# Altium project sigcarrier.PrjPcb (part 1 of 2)
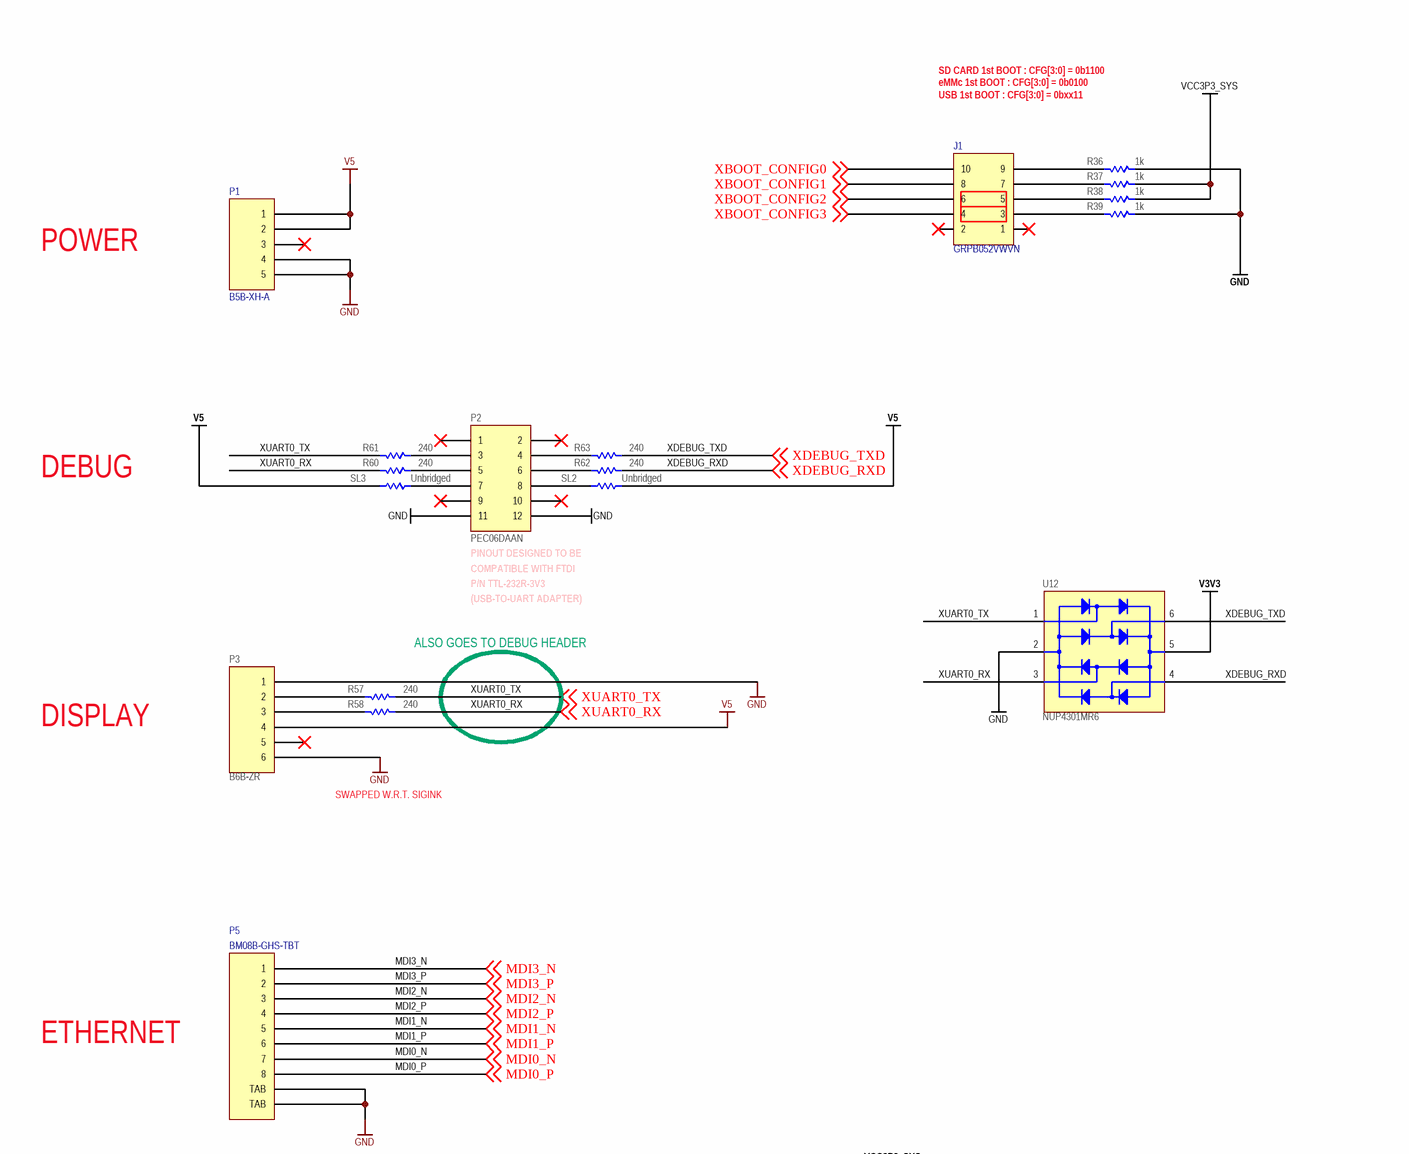
[diagram p0: 01_main.SchDoc, top left]
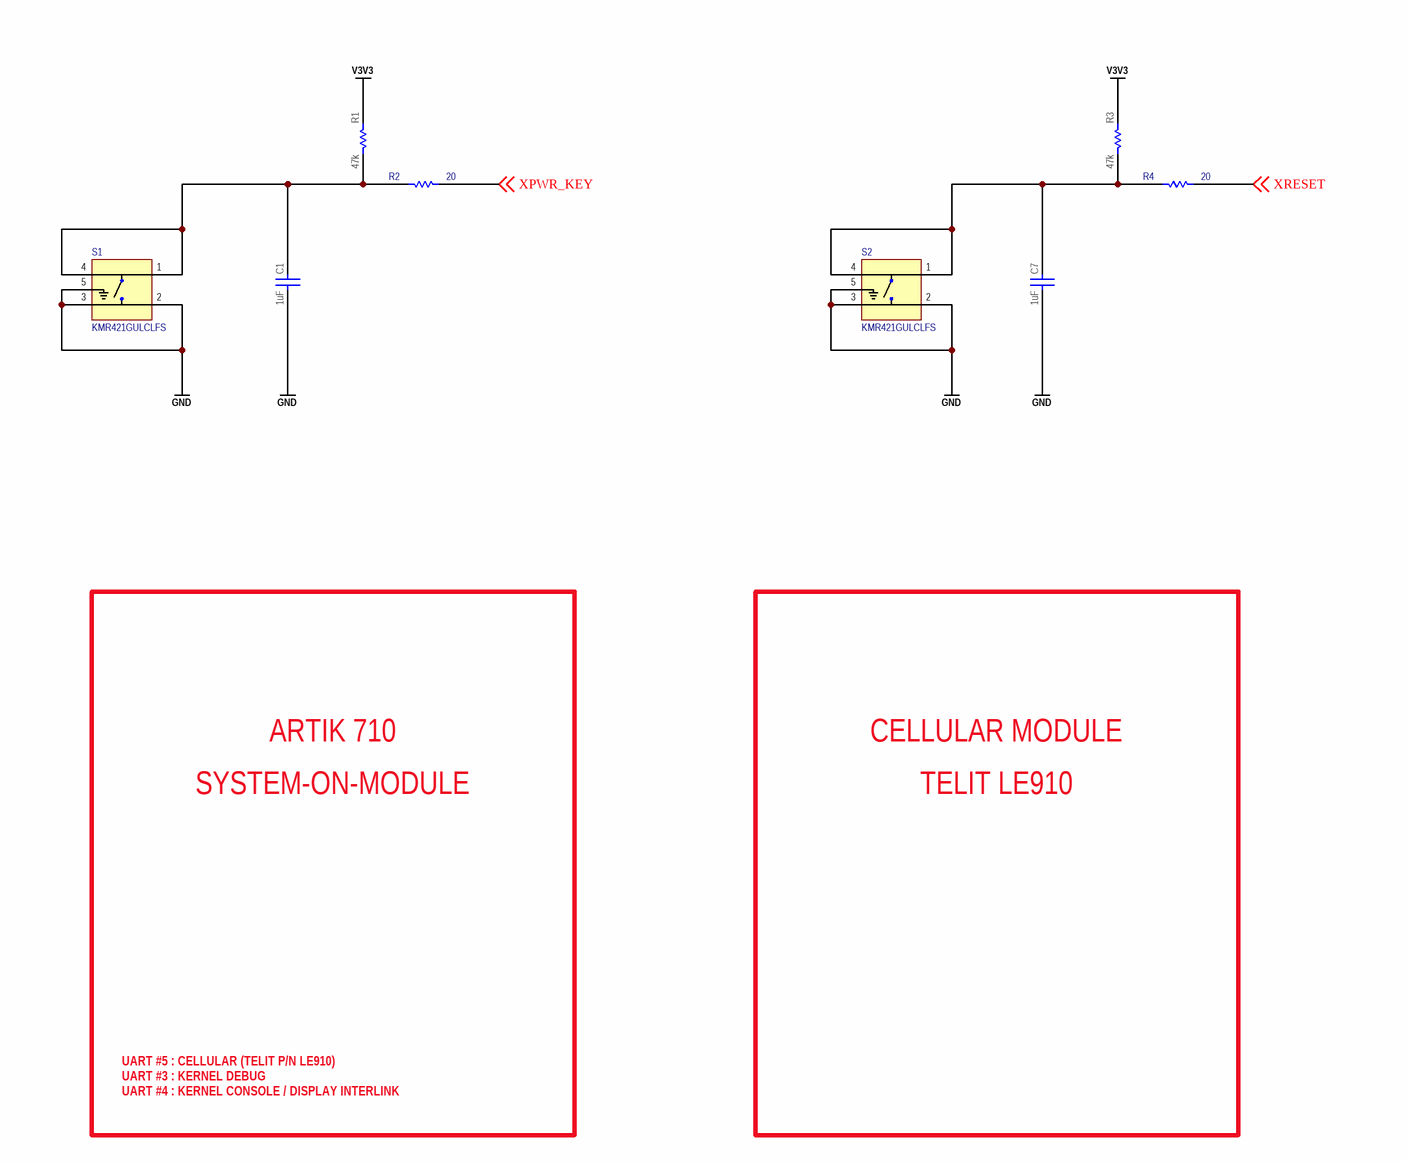
[diagram p1: 01_main.SchDoc, top right]
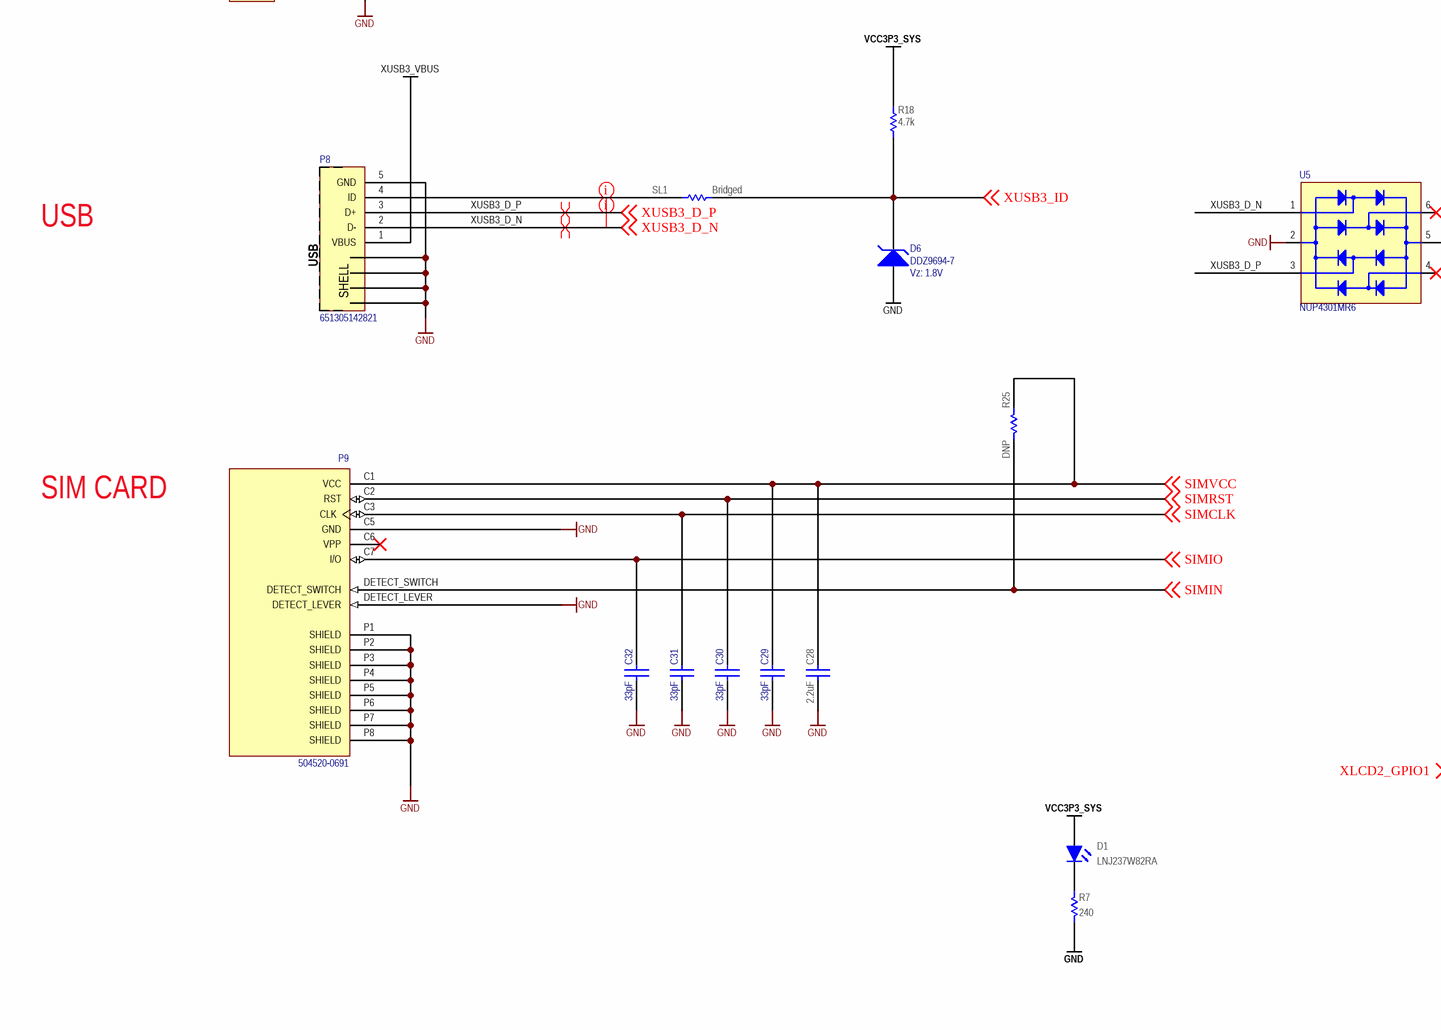
[diagram p2: 01_main.SchDoc, bottom left]
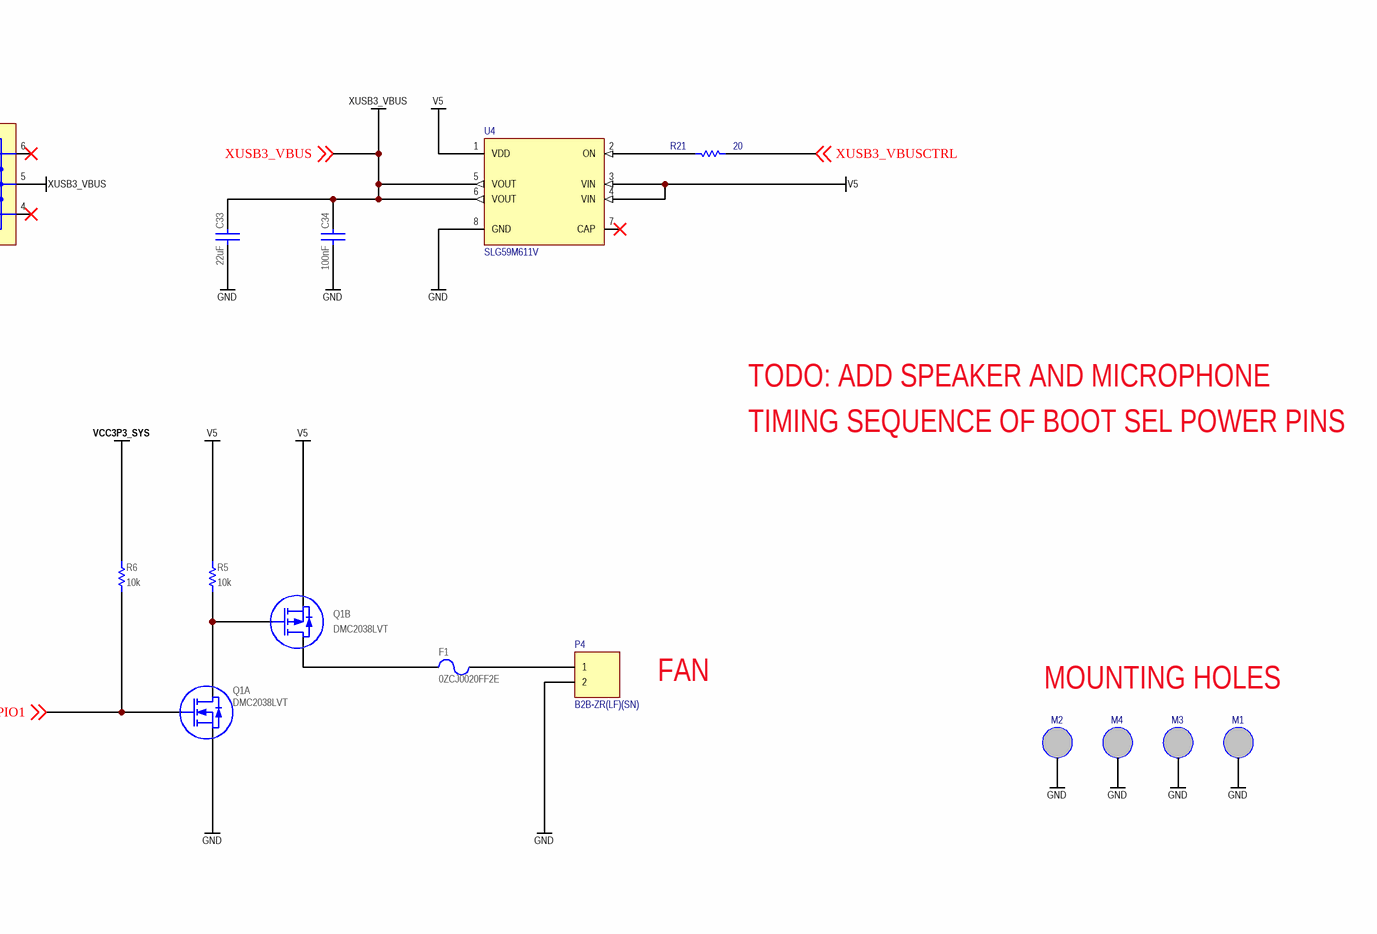
[diagram p3: 01_main.SchDoc, bottom right]
5 sheets, 184 parts. Net scope: global (net labels, ports and power ports of the same name join across sheets).
Board file: sigcarrier.PcbDoc
Sheets:
  01_main.SchDoc
  03_cellular.SchDoc
  02_som.SchDoc
  04_ethernet.SchDoc
  05_power.SchDoc

## Sheet 01_main.SchDoc
size C; CompanyName: Signal Laboratories, Inc.; Address1: 3479 Edison Way; Address2: Menlo Park CA 94025; Address3: +1 (877) 778-8435; Address4: siglabs.com; Revision: 1; SheetNumber: 1; SheetTotal: 1

### Parts
C1  value 1uF  [CAPC160X80X90L20N]  (hidden comment: C1608X7R1A105M080)
C7  value 1uF  [CAPC160X80X90L20N]  (hidden comment: C1608X7R1A105M080)
C28  value 2.2uF  [CAPC160X80X90L20N]  (hidden comment: C1608X7R1A225M080)
C29  value 33pF  [0402]  (hidden comment: CBR04C330F5GAC)
C30  value 33pF  [0402]  (hidden comment: CBR04C330F5GAC)
C31  value 33pF  [0402]  (hidden comment: CBR04C330F5GAC)
C32  value 33pF  [0402]  (hidden comment: CBR04C330F5GAC)
C33  value 22uF  [CAPC200X125X145L45N]  (hidden comment: C2012X7S1A226M125)
C34  value 100nF  [CAPC100X50X55L25N]  (hidden comment: GCM155R71H104KE02)
D1  LNJ237W82RA  [0603_LED]
D6  DDZ9694-7  Vz: 1.8V  [SOD123]
F1  0ZCJ0020FF2E  [1206]
J1  GRPB052VWVN  [GRPB052VWVN]
M1  MOUNT350  [mount350]  (value not drawn)  (no BOM)
M2  MOUNT350  [mount350]  (value not drawn)  (no BOM)
M3  MOUNT350  [mount350]  (value not drawn)  (no BOM)
M4  MOUNT350  [mount350]  (value not drawn)  (no BOM)
P1  B5B-XH-A  [B5B-XH-A]
P2  PEC06DAAN  [HDR2X6]
P3  B6B-ZR  [B6B-ZR]
P4  B2B-ZR(LF)(SN)  [B2B-ZR]
P5  BM08B-GHS-TBT  [BM08B-GHS-TBT]
P8  651305142821  [651305142821]
P9  504520-0691  [504520-0691]
Q1  DMC2038LVT  [TSOP-6]  (parts A,B of 2)
R1  value 47k  [RESC1005X40N]  (hidden comment: ERJ-2RKF4702X)
R2  value 20  [0402]  (hidden comment: ERJ-2RKF20R0X)
R3  value 47k  [RESC1005X40N]  (hidden comment: ERJ-2RKF4702X)
R4  value 20  [0402]  (hidden comment: ERJ-2RKF20R0X)
R5  value 10k  [RESC1005X40N]  (hidden comment: ERJ-2RKF1002X)
R6  value 10k  [RESC1005X40N]  (hidden comment: ERJ-2RKF1002X)
R7  value 240  [RESC1005X40N]  (hidden comment: ERJ-2RKF2400X)
R18  value 4.7k  [RESC1005X40N]  (hidden comment: ERJ-2RKF4701X)
R21  value 20  [0402]  (hidden comment: ERJ-2RKF20R0X)
R25  Do Not Place: DNP  [RESC1005X40N]  (hidden comment: ERJ-2RKF4702X)
R36  value 1k  [RESC1005X40N]  (hidden comment: ERJ-2RKF1001X)
R37  value 1k  [RESC1005X40N]  (hidden comment: ERJ-2RKF1001X)
R38  value 1k  [RESC1005X40N]  (hidden comment: ERJ-2RKF1001X)
R39  value 1k  [RESC1005X40N]  (hidden comment: ERJ-2RKF1001X)
R57  value 240  [RESC1005X40N]  (hidden comment: ERJ-2RKF2400X)
R58  value 240  [RESC1005X40N]  (hidden comment: ERJ-2RKF2400X)
R60  value 240  [RESC1005X40N]  (hidden comment: ERJ-2RKF2400X)
R61  value 240  [RESC1005X40N]  (hidden comment: ERJ-2RKF2400X)
R62  value 240  [RESC1005X40N]  (hidden comment: ERJ-2RKF2400X)
R63  value 240  [RESC1005X40N]  (hidden comment: ERJ-2RKF2400X)
S1  KMR421GULCLFS  [SW_KMR421GULCLFS]
S2  KMR421GULCLFS  [SW_KMR421GULCLFS]
SL1  value Bridged  [SOLDERLINK0603X26N_BRIDGED]  (hidden comment: SOLDER_LINK_BRIDGED)  (no BOM)
SL2  value Unbridged  [SOLDERLINK0603X26N]  (hidden comment: SOLDER_LINK)  (no BOM)
SL3  value Unbridged  [SOLDERLINK0603X26N]  (hidden comment: SOLDER_LINK)  (no BOM)
U4  SLG59M611V  [DFN200X150X80-8N]
U5  NUP4301MR6  [SOT23-6]
U12  NUP4301MR6  [SOT23-6]

### Nets
GND: C1.1 C7.1 C28.1 C29.2 C30.2 C31.2 C32.2 C33.1 C34.1 D6.1(A) M1.1(GND) M2.1(GND) M3.1(GND) M4.1(GND) P1.4 P1.5 P2.11 P2.12 P3.1 P3.6 P4.2 P5.9(TAB) P5.10(TAB) P8.5(GND) P8.SHELL(SHIELD) P8.SHELL1(SHIELD) P8.SHELL2(SHIELD) P8.SHELL3(SHIELD) P9.C5(GND) P9.DETECT_LEVER P9.P1(SHIELD) P9.P2(SHIELD) P9.P3(SHIELD) P9.P4(SHIELD) P9.P5(SHIELD) P9.P6(SHIELD) P9.P7(SHIELD) P9.P8(SHIELD) Q1.5(S) R7.2 R36.2 R39.2 S1.2 S1.3 S1.5(G) S2.2 S2.3 S2.5(G) U4.8(GND) U5.2(VN) U12.2(VN)
V3V3: R1.2 R3.2 U12.5(VP)
V5: P1.1 P1.2 P3.4 Q1.2(S) R5.2 SL2.2 SL3.1 U4.1(VDD) U4.3(VIN) U4.4(VIN)
VCC3P3_SYS: D1.1(A) R6.2 R18.2 R37.2 R38.2
XUSB3_VBUS: C33.2 C34.2 P8.1(VBUS) U4.5(VOUT) U4.6(VOUT) U5.5(VP) ; off-sheet XUSB3_VBUS
MDI0_N: P5.7 ; off-sheet MDI0_N
MDI0_P: P5.8 ; off-sheet MDI0_P
MDI1_N: P5.5 ; off-sheet MDI1_N
MDI1_P: P5.6 ; off-sheet MDI1_P
MDI2_N: P5.3 ; off-sheet MDI2_N
MDI2_P: P5.4 ; off-sheet MDI2_P
MDI3_N: P5.1 ; off-sheet MDI3_N
MDI3_P: P5.2 ; off-sheet MDI3_P
SIMCLK: C31.1 P9.C3(CLK) ; off-sheet SIMCLK
SIMIN: P9.DETECT_SWITCH R25.1 ; off-sheet SIMIN
SIMIO: C32.1 P9.C7(I/O) ; off-sheet SIMIO
SIMRST: C30.1 P9.C2(RST) ; off-sheet SIMRST
SIMVCC: C28.2 C29.1 P9.C1(VCC) R25.2 ; off-sheet SIMVCC
XBOOT_CONFIG0: J1.10 ; off-sheet XBOOT_CONFIG0
XBOOT_CONFIG1: J1.8 ; off-sheet XBOOT_CONFIG1
XBOOT_CONFIG2: J1.6 ; off-sheet XBOOT_CONFIG2
XBOOT_CONFIG3: J1.4 ; off-sheet XBOOT_CONFIG3
XDEBUG_RXD: R62.2 U12.4(C) ; off-sheet XDEBUG_RXD
XDEBUG_TXD: R63.2 U12.6(D) ; off-sheet XDEBUG_TXD
XLCD2_GPIO1: Q1.1(G) R6.1 ; off-sheet XLCD2_GPIO1
XPWR_KEY: R2.2 ; off-sheet XPWR_KEY
XRESET: R4.2 ; off-sheet XRESET
XUART0_RX: R58.2 R60.1 U12.3(B) ; off-sheet XUART0_RX
XUART0_TX: R57.2 R61.1 U12.1(A) ; off-sheet XUART0_TX
XUSB3_D_N: P8.2(D-) U5.1(A) ; off-sheet XUSB3_D_N
XUSB3_D_P: P8.3(D+) U5.3(B) ; off-sheet XUSB3_D_P
XUSB3_ID: D6.2(C) R18.1 SL1.2 ; off-sheet XUSB3_ID
XUSB3_VBUSCTRL: R21.2 ; off-sheet XUSB3_VBUSCTRL
NetC1_2: C1.2 R1.1 R2.1 S1.1 S1.4
NetC7_2: C7.2 R3.1 R4.1 S2.1 S2.4
NetD1_2: D1.2(K) R7.1
NetF1_1: F1.1 Q1.4(D)
NetF1_2: F1.2 P4.1
NetJ1_3: J1.3 R39.1
NetJ1_5: J1.5 R38.1
NetJ1_7: J1.7 R37.1
NetJ1_9: J1.9 R36.1
NetP2_3: P2.3 R61.2
NetP2_4: P2.4 R63.1
NetP2_5: P2.5 R60.2
NetP2_6: P2.6 R62.1
NetP2_7: P2.7 SL3.2
NetP2_8: P2.8 SL2.1
NetP3_2: P3.2 R57.1
NetP3_3: P3.3 R58.1
NetP8_4: P8.4(ID) SL1.1
NetQ1_3: Q1.3(G) Q1.6(D) R5.1
NetR21_1: R21.1 U4.2(ON)

Not connected (* = marked no-connect by the designer): J1 1* 2*; P1 3*; P2 1* 2* 9* 10*; P3 5*; P9 C6(VPP)*; U4 7(CAP)*; U5 4(C)* 6(D)*

### Layout directives
net class USB: XUSB3_D_N, XUSB3_D_P
differential pair: XUSB3_D_N, XUSB3_D_P

### Notes on the sheet
- SD CARD 1st BOOT : CFG[3:0] = 0b1100
  eMMc 1st BOOT : CFG[3:0] = 0b0100
  USB 1st BOOT : CFG[3:0] = 0bxx11
- POWER
- DEBUG
- (near P2) PINOUT DESIGNED TO BE
- (near P2) COMPATIBLE WITH FTDI
- P/N TTL-232R-3V3
- (USB-TO-UART ADAPTER)
- ALSO GOES TO DEBUG HEADER
- DISPLAY
- ARTIK 710
- CELLULAR MODULE
- SWAPPED W.R.T. SIGINK
- SYSTEM-ON-MODULE
- TELIT LE910
- ETHERNET
- UART #5 : CELLULAR (TELIT P/N LE910)
  UART #3 : KERNEL DEBUG
  UART #4 : KERNEL CONSOLE / DISPLAY INTERLINK
- USB
- TODO: ADD SPEAKER AND MICROPHONE
- SIM CARD
- TIMING SEQUENCE OF BOOT SEL POWER PINS
- FAN
- MOUNTING HOLES
- Title
- Engineer
- Revision
- Drawn By
- Sheet
- of
- Checked By
- Date
- (in symbol 651305142821) USB

### Library data of the parts
C1 C7 = CAP: Ceramic Capacitor 1uF ±20% 10V X7R 0603; Manufacturer: TDK; Tr: -55:125; Manufacturer P/N: C1608X7R1A105M080; Tolerance: ±20%; Voltage: 10V; Footprint: *; Package: 0603
C28 = CAP: Ceramic Capacitor 2.2uF ±20% 10V X7R 0603; Manufacturer: TDK; Tr: -55:125; Manufacturer P/N: C1608X7R1A225M080; Tolerance: ±20%; Voltage: 10V; Footprint: *; Package: 0603
C29-C32 = CAP 0603: Ceramic Capacitor 33pF ±1% 50V NP0 0402; Manufacturer: Kemet; Tr: -55:125; Voltage: 50V; Manufacturer P/N: CBR04C330F5GAC; Package: 0402; Do Not Place: *; Tolerance: ±1%
C33 = CAP: Ceramic Capacitor 22uF ±20% 10V X7S 0805; Manufacturer: TDK; Tr: -55:125; Manufacturer P/N: C2012X7S1A226M125; Tolerance: ±20%; Voltage: 10V; Package: 0805
C34 = CAP: Ceramic Capacitor 100nF ±10% 50V X7R 0402; Manufacturer: Murata; Tr: -55:125; Manufacturer P/N: GCM155R71H104KE02; Tolerance: ±10%; Voltage: 50V; Footprint: *; Package: 0402
D1 = LED0603RD: LED, SMT 0603, Color Red, 5mA, 1.85V; Manufacturer: Panasonic; Manufacturer P/N: LNJ237W82RA; Package: 0603 Polarized
D6 = DDZ9694-7: Zener Diode 1.8V 500mW SOD123; Manufacturer P/N: DDZ9678-7; Manufacturer: Diodes, Inc.
F1 = 0ZCJ0020FF2E: PTC Resettable Fuse, 0.2A, 30V, SMD 1206; Manufacturer: Bell Fuse; Manufacturer P/N: 0ZCJ0020FF2E
J1 = GRPB052VWVN: Male Header, 0.050" Pitch, 2x5 Position; Manufacturer: Sullins; Manufacturer P/N: GRPB052VWVN
M1-M4 = M3_HOLE
P1 = B5B-XH-A: 2.5mm pitch 5-position; Manufacturer: JST; Manufacturer P/N: B5B-XH-A
P2 = Header 6X2H: Header, 6-Pin, Dual row; Manufacturer: Sullins; Manufacturer P/N: PEC06DAAN
P3 = TBD: Header, 6-Pin, Single row, Vertical; Manufacturer: JST; Manufacturer P/N: B6B-ZR
P4 = Header 2: Header, 2-Pin; Manufacturer: JST; Manufacturer P/N: B2B-ZR(LF)(SN)
P5 = BM08B-GHS-TBT: Top Entry Shrouded Connector; 8-position; Manufacturer: JST; Manufacturer P/N: BM08B-GHS-TBT
P8 = 651305142821: Right Angle SMT USB Type-AB Connector Receptacle; Manufacturer: Wurth Elektronik; Manufacturer P/N: 651305142821
P9 = 504520-0691: micro-SIM Card Connector; Manufacturer: Molex; Availability: Good; Package: None; Manufacturer P/N: 504520-0691; Price: 1.31 USD; Value: *
Q1 = DMC2038LVT: Complementary MOSFET Pair; Manufacturer: Diodes, Inc.; Manufacturer P/N: DMC2038LVT
R1 R3 R25 = RES: Thick Film Resistor 47k ±1% 0.1W 75V 0402; Manufacturer: Panasonic; Tcr: ±100; Tr: -55:155; Voltage: 75; Power: 0.1; Tolerance: ±1%; Manufacturer P/N: ERJ-2RKF4702X; Alternatives: *; Footprint: *; Package: 0402
  R25: Value: 47k
R2 R4 R21 = RES 0402: Thick Film Resistor 20 ±1% 0402; Manufacturer: Panasonic; Manufacturer P/N: RC0402FR-0720L; Tr: -55:155; Package: 0402; Tolerance: ±1%
R5 R6 = RES: Thick Film Resistor 10k ±1% 0.1W 0402; Manufacturer: Panasonic; Tcr: ±100; Tr: -55:155; Voltage: 50; Power: 0.1; Manufacturer P/N: ERJ-2RKF1002X; Tolerance: ±1%; Alternatives: *; Footprint: *; Package: 0402
R7 R57 R58 R60-R63 = RES: Thick Film Resistor 240 ±1% 0.1W 75V 0402; Manufacturer: Panasonic; Tcr: ±100; Tr: -55:155; Voltage: 75; Power: 0.1; Tolerance: ±1%; Manufacturer P/N: ERJ-2RKF2400X; Alternatives: *; Footprint: *; Package: 0402
R18 = RES: Thick Film Resistor 4.7k ±1% 0.1W 75V 0402; Manufacturer: Panasonic; Tcr: ±100; Tr: -55:155; Voltage: 75; Power: 0.1; Tolerance: ±1%; Manufacturer P/N: ERJ-2RKF4701X; Alternatives: *; Footprint: *; Package: 0402
R36-R39 = RES: Thick Film Resistor 1k ±1% 0.1W 0402; Manufacturer: Panasonic; Tcr: ±100; Tr: -55:155; Voltage: 75; Power: 0.1; Tolerance: ±1%; Manufacturer P/N: ERJ-2RKF1001X; Alternatives: *; Footprint: *; Package: 0402
S1 S2 = KMR421GULCLFS: Switch Tactile N.O. SPST Round Button Gull Wing 0.05A 32VDC 1VA 200000Cycles 2N SMD Automotive T/R; Manufacturer: C&K Components; Availability: Good; Package: None; Manufacturer P/N: KMR421GULCLFS; Price: 0.29 USD; Value: *
SL1 = RES: Solder Link Bridged; Manufacturer P/N: *; Manufacturer: *
SL2 SL3 = RES: Solder Link Unbridged; Manufacturer P/N: *; Manufacturer: *
U4 = SLG59M611V: High-Side Load Switch; Manufacturer: Silego; Package: WFDFN-8 Silego; Manufacturer P/N: SLG59M611V
U5 U12 = NUP4301MR6: 4-Lane TVS Diode Array; Manufacturer: On Semiconductor; Manufacturer P/N: NUP4301MR6

## Sheet 03_cellular.SchDoc
size D; CompanyName: Signal Laboratories, Inc.; Address1: 3479 Edison Way; Address2: Menlo Park CA 94025; Address3: +1 (877) 778-8435; Address4: siglabs.com; Revision: 1; SheetNumber: 1; SheetTotal: 1
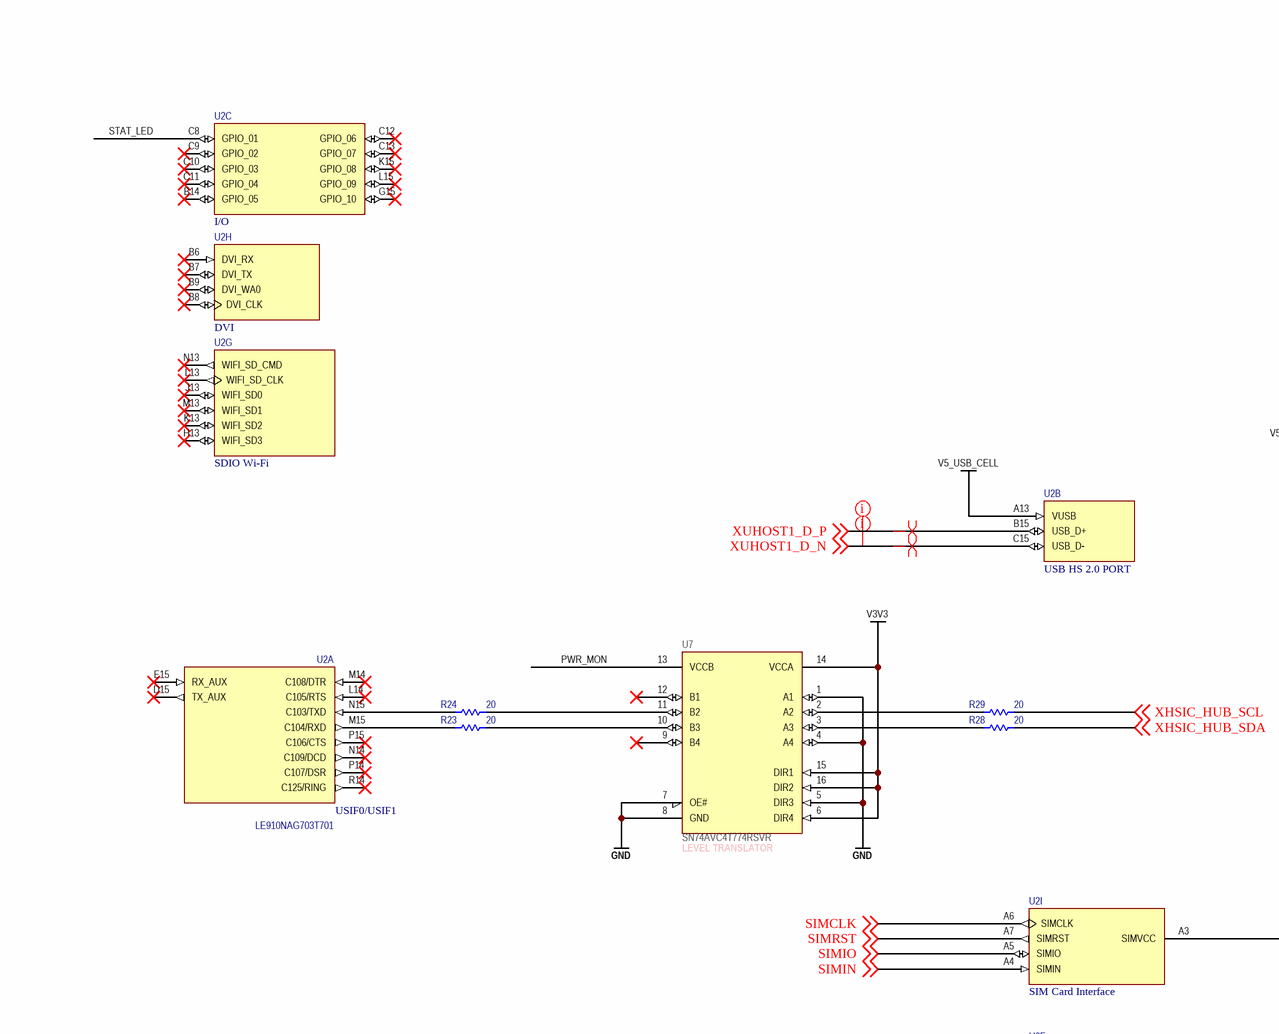
[diagram p4: 03_cellular.SchDoc, top left]
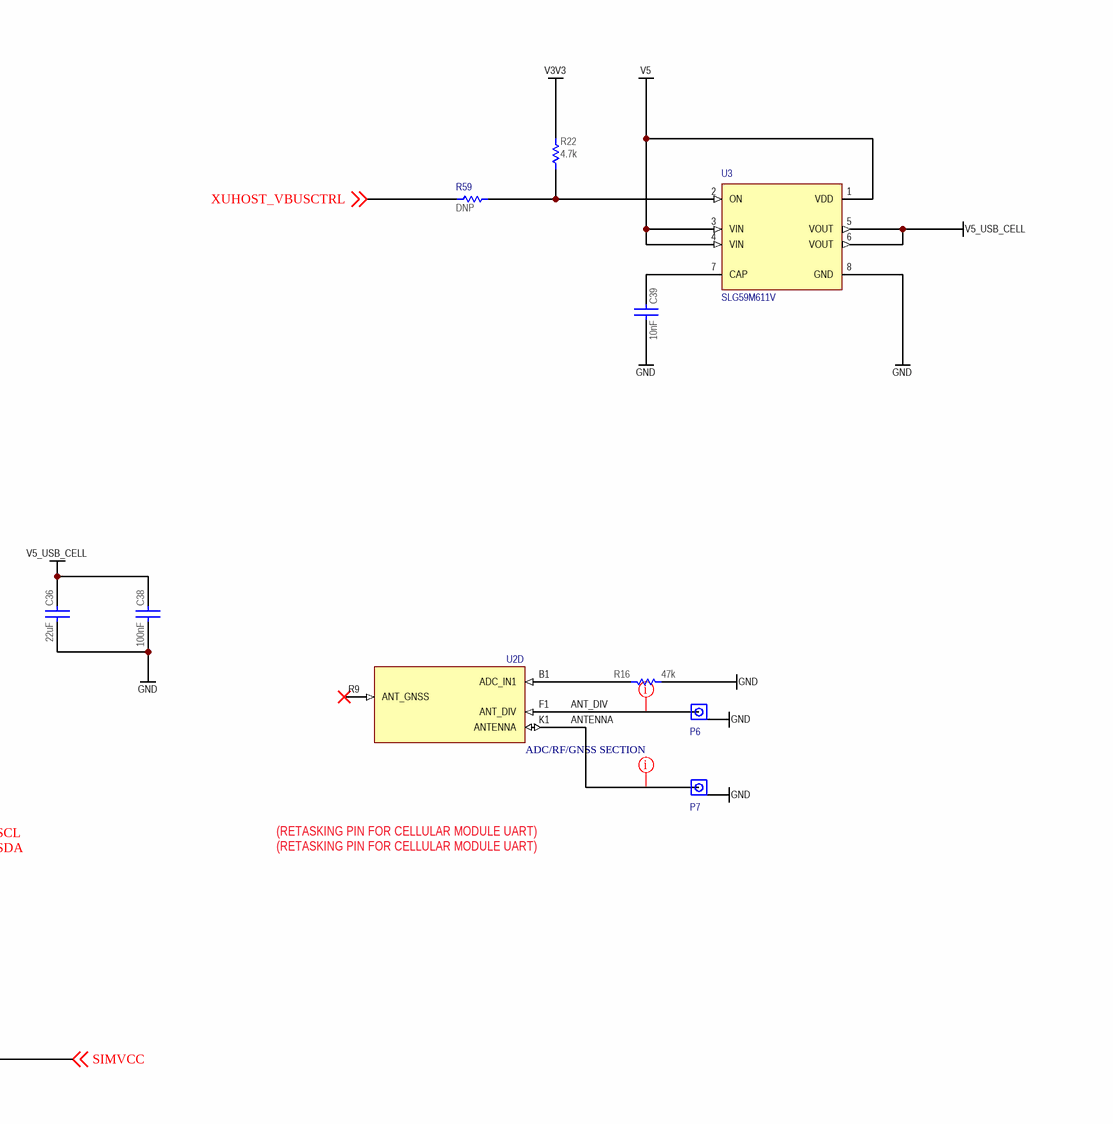
[diagram p5: 03_cellular.SchDoc, top right]
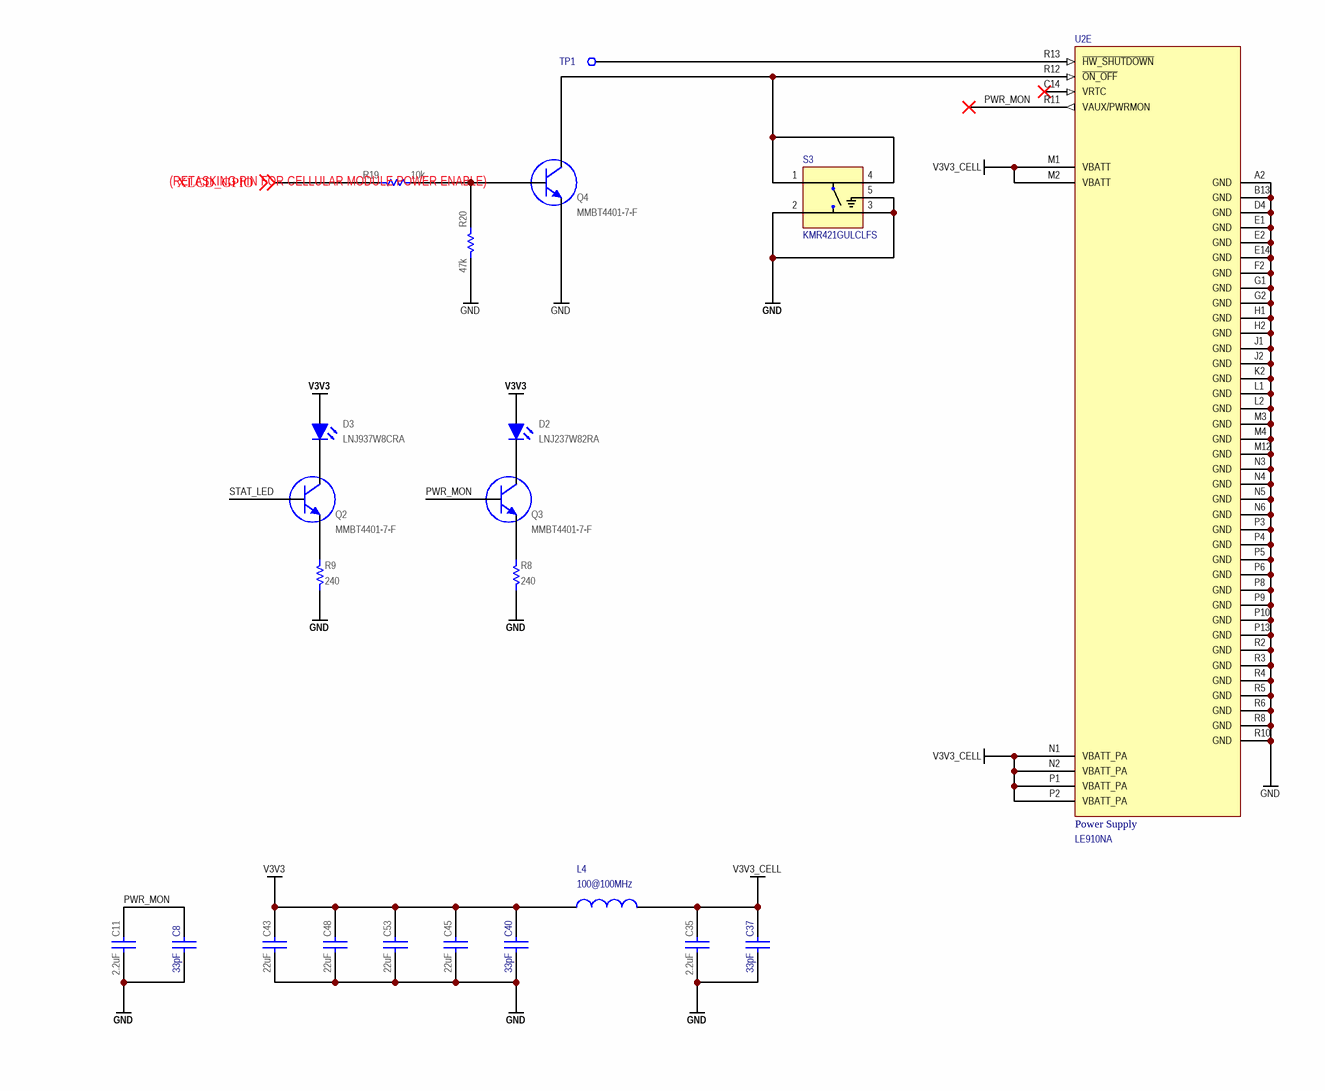
[diagram p6: 03_cellular.SchDoc, bottom left]
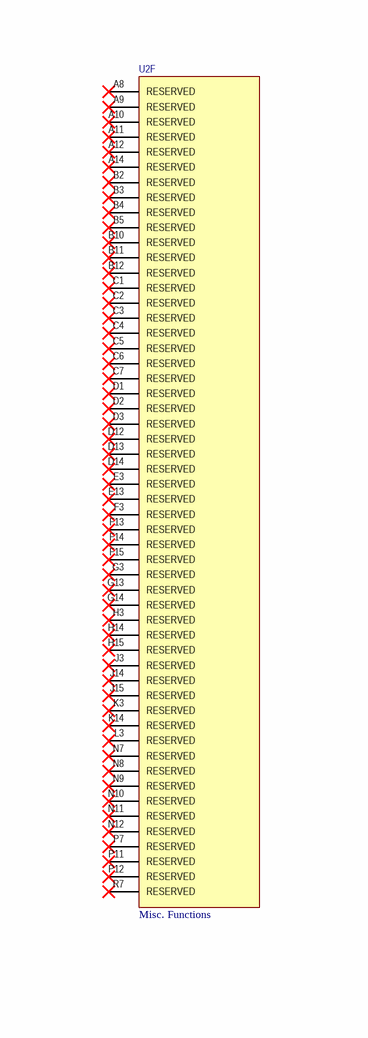
[diagram p7: 03_cellular.SchDoc, bottom right]

### Parts
C8  value 33pF  [0402]  (hidden comment: CBR04C330F5GAC)
C11  value 2.2uF  [CAPC160X80X90L20N]  (hidden comment: C1608X7R1A225M080)
C35  value 2.2uF  [CAPC160X80X90L20N]  (hidden comment: C1608X7R1A225M080)
C36  value 22uF  [CAPC200X125X145L45N]  (hidden comment: C2012X7S1A226M125)
C37  value 33pF  [0402]  (hidden comment: CBR04C330F5GAC)
C38  value 100nF  [CAPC100X50X55L25N]  (hidden comment: GCM155R71H104KE02)
C39  value 10nF  [CAPC100X50X55L25N]  (hidden comment: GCM155R71H103KA55)
C40  value 33pF  [0402]  (hidden comment: CBR04C330F5GAC)
C43  value 22uF  [CAPC200X125X145L45N]  (hidden comment: C2012X7S1A226M125)
C45  value 22uF  [CAPC200X125X145L45N]  (hidden comment: C2012X7S1A226M125)
C48  value 22uF  [CAPC200X125X145L45N]  (hidden comment: C2012X7S1A226M125)
C53  value 22uF  [CAPC200X125X145L45N]  (hidden comment: C2012X7S1A226M125)
D2  LNJ237W82RA  [0603_LED]
D3  LNJ937W8CRA  [0603_LED]
L4  value 100@100MHz  [0603]  (hidden comment: BLM15PX601SN1D)
P6  U.FL-R-SMT(10)  [U.FL-R-SMT(10)]  (value not drawn)
P7  U.FL-R-SMT(10)  [U.FL-R-SMT(10)]  (value not drawn)
Q2  MMBT4401-7-F  [SOT23]
Q3  MMBT4401-7-F  [SOT23]
Q4  MMBT4401-7-F  [SOT23]
R8  value 240  [RESC1005X40N]  (hidden comment: ERJ-2RKF2400X)
R9  value 240  [RESC1005X40N]  (hidden comment: ERJ-2RKF2400X)
R16  value 47k  [RESC1005X40N]  (hidden comment: ERJ-2RKF4702X)
R19  value 10k  [RESC1005X40N]  (hidden comment: ERJ-2RKF1002X)
R20  value 47k  [RESC1005X40N]  (hidden comment: ERJ-2RKF4702X)
R22  value 4.7k  [RESC1005X40N]  (hidden comment: ERJ-2RKF4701X)
R23  value 20  [0402]  (hidden comment: ERJ-2RKF20R0X)
R24  value 20  [0402]  (hidden comment: ERJ-2RKF20R0X)
R28  value 20  [0402]  (hidden comment: ERJ-2RKF20R0X)
R29  value 20  [0402]  (hidden comment: ERJ-2RKF20R0X)
R59  Do Not Place: DNP  [0402]  (hidden comment: ERJ-2RKF20R0X)
S3  KMR421GULCLFS  [SW_KMR421GULCLFS]
TP1  TEST_POINT_SMD_10  [TEST_POINT_SMD_10]  (value not drawn)  (no BOM)
U2  LE910NAG703T701  [LGA144S180P15X15_2820X2820X225_LE910NAG703T701(Primary)]  (parts A,B,C,D,E,F,G,H,I of 9)
U3  SLG59M611V  [DFN200X150X80-8N]
U7  SN74AVC4T774RSVR  [RSV]

### Nets
GND: C8.2 C11.1 C35.1 C36.1 C37.2 C38.1 C39.1 C40.2 C43.1 C45.1 C48.1 C53.1 P6.2(GND) P7.2(GND) Q4.2(E) R8.2 R9.2 R16.1 R20.1 S3.2 S3.3 S3.5(G) U2.A2(GND) U2.B13(GND) U2.D4(GND) U2.E1(GND) U2.E2(GND) U2.E14(GND) U2.F2(GND) U2.G1(GND) U2.G2(GND) U2.H1(GND) U2.H2(GND) U2.J1(GND) U2.J2(GND) U2.K2(GND) U2.L1(GND) U2.L2(GND) U2.M3(GND) U2.M4(GND) U2.M12(GND) U2.N3(GND) U2.N4(GND) U2.N5(GND) U2.N6(GND) U2.P3(GND) U2.P4(GND) U2.P5(GND) U2.P6(GND) U2.P8(GND) U2.P9(GND) U2.P10(GND) U2.P13(GND) U2.R2(GND) U2.R3(GND) U2.R4(GND) U2.R5(GND) U2.R6(GND) U2.R8(GND) U2.R10(GND) U3.8(GND) U7.1(A1) U7.4(A4) U7.5(DIR3) U7.7(OE#) U7.8(GND)
V3V3: C40.1 C43.2 C45.2 C48.2 C53.2 D2.1(A) D3.1(A) L4.1 R22.2 U7.6(DIR4) U7.14(VCCA) U7.15(DIR1) U7.16(DIR2)
V3V3_CELL: C35.2 C37.1 L4.2 U2.M1(VBATT) U2.M2(VBATT) U2.N1(VBATT_PA) U2.N2(VBATT_PA) U2.P1(VBATT_PA) U2.P2(VBATT_PA)
V5: U3.1(VDD) U3.3(VIN) U3.4(VIN)
V5_USB_CELL: C36.2 C38.2 U2.A13(VUSB) U3.5(VOUT) U3.6(VOUT)
ANT_DIV: P6.1(RF) U2.F1(ANT_DIV)
ANTENNA: P7.1(RF) U2.K1(ANTENNA)
PWR_MON: C8.1 C11.2 Q3.1(B) U2.R11(VAUX/PWRMON) U7.13(VCCB)
SIMCLK: U2.A6(SIMCLK) ; off-sheet SIMCLK
SIMIN: U2.A4(SIMIN) ; off-sheet SIMIN
SIMIO: U2.A5(SIMIO) ; off-sheet SIMIO
SIMRST: U2.A7(SIMRST) ; off-sheet SIMRST
SIMVCC: U2.A3(SIMVCC) ; off-sheet SIMVCC
STAT_LED: Q2.1(B) U2.C8(GPIO_01)
XHSIC_HUB_SCL: R29.1 ; off-sheet XHSIC_HUB_SCL
XHSIC_HUB_SDA: R28.1 ; off-sheet XHSIC_HUB_SDA
XLCD_GPIO: R19.2 ; off-sheet XLCD_GPIO
XUHOST1_D_N: U2.C15(USB_D-) ; off-sheet XUHOST1_D_N
XUHOST1_D_P: U2.B15(USB_D+) ; off-sheet XUHOST1_D_P
XUHOST_VBUSCTRL: R59.2 ; off-sheet XUHOST_VBUSCTRL
NetC39_2: C39.2 U3.7(CAP)
NetD2_2: D2.2(K) Q3.3(C)
NetD3_2: D3.2(K) Q2.3(C)
NetQ2_2: Q2.2(E) R9.1
NetQ3_2: Q3.2(E) R8.1
NetQ4_1: Q4.1(B) R19.1 R20.2
NetQ4_3: Q4.3(C) S3.1 S3.4 U2.R12(~{ON_OFF})
NetR16_2: R16.2 U2.B1(ADC_IN1)
NetR22_1: R22.1 R59.1 U3.2(ON)
NetR23_1: R23.1 U7.10(B3)
NetR23_2: R23.2 U2.M15(C104/RXD)
NetR24_1: R24.1 U7.11(B2)
NetR24_2: R24.2 U2.N15(C103/TXD)
NetR28_2: R28.2 U7.3(A3)
NetR29_2: R29.2 U7.2(A2)
NetTP1_1: TP1.1 U2.R13(~{HW_SHUTDOWN})

Not connected (* = marked no-connect by the designer): U2 A8(RESERVED)* A9(RESERVED)* A10(RESERVED)* A11(RESERVED)* A12(RESERVED)* A14(RESERVED)* B2(RESERVED)* B3(RESERVED)* B4(RESERVED)* B5(RESERVED)* B6(DVI_RX)* B7(DVI_TX)* B8(DVI_CLK)* B9(DVI_WA0)* B10(RESERVED)* B11(RESERVED)* B12(RESERVED)* B14(GPIO_05)* C1(RESERVED)* C2(RESERVED)* C3(RESERVED)* C4(RESERVED)* C5(RESERVED)* C6(RESERVED)* C7(RESERVED)* C9(GPIO_02)* C10(GPIO_03)* C11(GPIO_04)* C12(GPIO_06)* C13(GPIO_07)* C14(VRTC)* D1(RESERVED)* D2(RESERVED)* D3(RESERVED)* D12(RESERVED)* D13(RESERVED)* D14(RESERVED)* D15(TX_AUX)* E3(RESERVED)* E13(RESERVED)* E15(RX_AUX)* F3(RESERVED)* F13(RESERVED)* F14(RESERVED)* F15(RESERVED)* G3(RESERVED)* G13(RESERVED)* G14(RESERVED)* G15(GPIO_10)* H3(RESERVED)* H13(WIFI_SD3)* H14(RESERVED)* H15(RESERVED)* J3(RESERVED)* J13(WIFI_SD0)* J14(RESERVED)* J15(RESERVED)* K3(RESERVED)* K13(WIFI_SD2)* K14(RESERVED)* K15(GPIO_08)* L3(RESERVED)* L13(WIFI_SD_CLK)* L14(C105/RTS)* L15(GPIO_09)* M13(WIFI_SD1)* M14(C108/DTR)* N7(RESERVED)* N8(RESERVED)* N9(RESERVED)* N10(RESERVED)* N11(RESERVED)* N12(RESERVED)* N13(WIFI_SD_CMD)* N14(C109/DCD)* P7(RESERVED)* P11(RESERVED)* P12(RESERVED)* P14(C107/DSR)* P15(C106/CTS)* R7(RESERVED)* R9(ANT_GNSS)* R14(C125/RING)*; U7 9(B4)* 12(B1)*

### Layout directives
net class RF: ANT_DIV, ANTENNA
net class USB: XUHOST1_D_N, XUHOST1_D_P
differential pair: XUHOST1_D_N, XUHOST1_D_P

### Notes on the sheet
- (RETASKING PIN FOR CELLULAR MODULE UART)
- (near U7) LEVEL TRANSLATOR
- (RETASKING PIN FOR CELLULAR MODULE POWER ENABLE)
- Title
- Engineer
- Revision
- Drawn By
- Sheet
- of
- Checked By
- Date
- (in symbol LE910NAG703T701, part A) USIF0/USIF1
- (in symbol LE910NAG703T701, part B) USB HS 2.0 PORT
- (in symbol LE910NAG703T701, part C) I/O
- (in symbol LE910NAG703T701, part D) ADC/RF/GNSS SECTION
- (in symbol LE910NAG703T701, part E) Power Supply
- (in symbol LE910NAG703T701, part F) Misc. Functions
- (in symbol LE910NAG703T701, part G) SDIO Wi-Fi
- (in symbol LE910NAG703T701, part H) DVI
- (in symbol LE910NAG703T701, part I) SIM Card Interface

### Library data of the parts
C8 C37 C40 = CAP 0603: as C29 on sheet 01_main; Voltage: 50V; Manufacturer P/N: CBR04C330F5GAC; Package: 0402; Do Not Place: *; Tolerance: ±1%
C11 C35 = CAP: as C28 on sheet 01_main; Manufacturer P/N: C1608X7R1A225M080; Tolerance: ±20%; Voltage: 10V; Footprint: *; Package: 0603
C36 C43 C45 C48 C53 = CAP: as C33 on sheet 01_main; Manufacturer P/N: C2012X7S1A226M125; Tolerance: ±20%; Voltage: 10V; Package: 0805
C38 = CAP: as C34 on sheet 01_main; Manufacturer P/N: GCM155R71H104KE02; Tolerance: ±10%; Voltage: 50V; Footprint: *; Package: 0402
C39 = CAP: Ceramic Capacitor 10nF ±10% 50V X7R 0402; Manufacturer: Murata; Tr: -55:125; Manufacturer P/N: GCM155R71H103KA55; Tolerance: ±10%; Voltage: 50V; Footprint: *; Package: 0402
D2 = LED0603RD: as D1 on sheet 01_main; Manufacturer P/N: LNJ237W82RA; Package: 0603 Polarized
D3 = LED0603GR: LED, SMT 0603, Color Blue, 5mA, 2.9V; Manufacturer: Panasonic; Manufacturer P/N: LNJ937W8CRA; Package: 0603 Polarized
L4 = IND 0402: Ferrite Bead 100-Ohm @ 100MHz 2A 0603; Manufacturer: Murata; Manufacturer P/N: BLM18EG101TN1; Tolerance: ±25%; Tr: -55:125; Package: 0603
P6 P7 = U.FL-R-SMT(10): Ultra Miniature Coaxial Jack, 50 Ohms; Manufacturer: Hirose; Manufacturer P/N: U.FL-R-SMT(10)
Q2-Q4 = MMBT4401-7-F: NPN Small Signal Transistor SMD SOT-23; Manufacturer: Diodes, Inc.; Manufacturer P/N: MMBT4401-7-F
R8 R9 = RES: as R7 on sheet 01_main; Tolerance: ±1%; Manufacturer P/N: ERJ-2RKF2400X; Alternatives: *; Footprint: *; Package: 0402
R16 R20 = RES: as R1 on sheet 01_main; Tolerance: ±1%; Manufacturer P/N: ERJ-2RKF4702X; Alternatives: *; Footprint: *; Package: 0402
R19 = RES: Thick Film Resistor 10k ±1% 0.1W 0402; Manufacturer: Panasonic; Tcr: ±100; Tr: -55:155; Voltage: 75; Power: 0.1; Tolerance: ±1%; Manufacturer P/N: ERJ-2RKF1002X; Alternatives: *; Footprint: *; Package: 0402
R22 = RES: as R18 on sheet 01_main; Tolerance: ±1%; Manufacturer P/N: ERJ-2RKF4701X; Alternatives: *; Footprint: *; Package: 0402
R23 R24 R28 R29 = RES 0402: as R2 on sheet 01_main; Package: 0402; Tolerance: ±1%
R59 = RES 0402: Thick Film Resistor 20 ±1% 0402; Manufacturer: Panasonic; Manufacturer P/N: RC0402FR-0720L; Value: 20; Tr: -55:155; Package: 0402; Tolerance: ±1%
S3 = KMR421GULCLFS: as S1 on sheet 01_main; Availability: Good; Package: None; Manufacturer P/N: KMR421GULCLFS; Price: 0.29 USD; Value: *
TP1 = TEST_POINT_SMD_10: Test Point SMD
U2 = LE910NAG703T701: Manufacturer: Telit; Manufacturer P/N: LE910NAG703T701
U3 = SLG59M611V: as U4 on sheet 01_main; Package: WFDFN-8 Silego; Manufacturer P/N: SLG59M611V
U7 = SN74AVC4T774RSVR: 4-Bit Dual-Supply Bus Transceiver; Manufacturer: Texas Instruments; Manufacturer P/N: SN74AVC4T774RSVR

## Sheet 02_som.SchDoc
size D; CompanyName: Signal Laboratories, Inc.; Address1: 3479 Edison Way; Address2: Menlo Park CA 94025; Address3: +1 (877) 778-8435; Address4: siglabs.com; Revision: 1; SheetNumber: 1; SheetTotal: 1
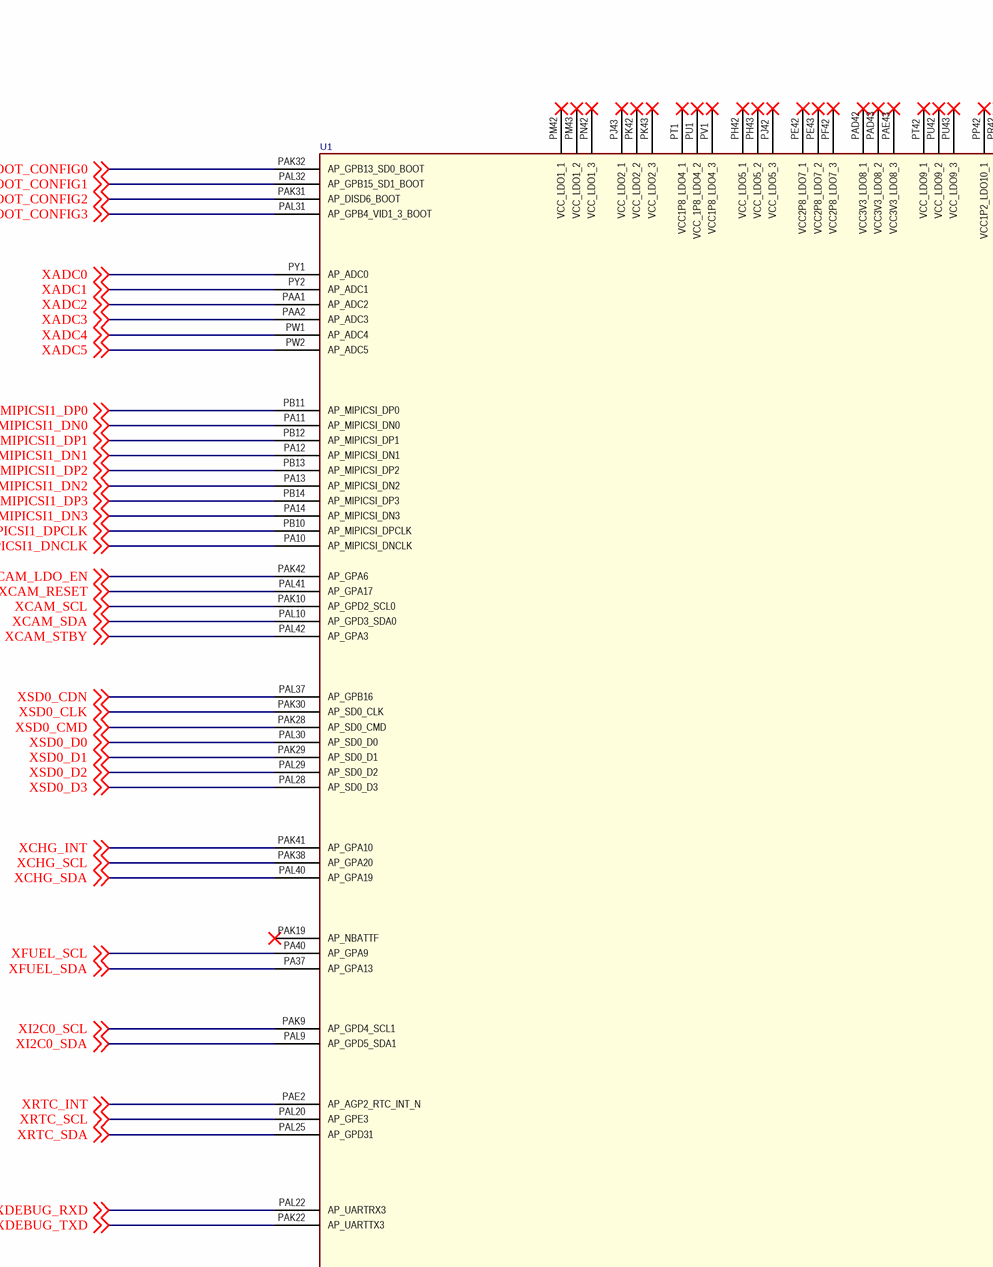
[diagram p8: 02_som.SchDoc, top left]
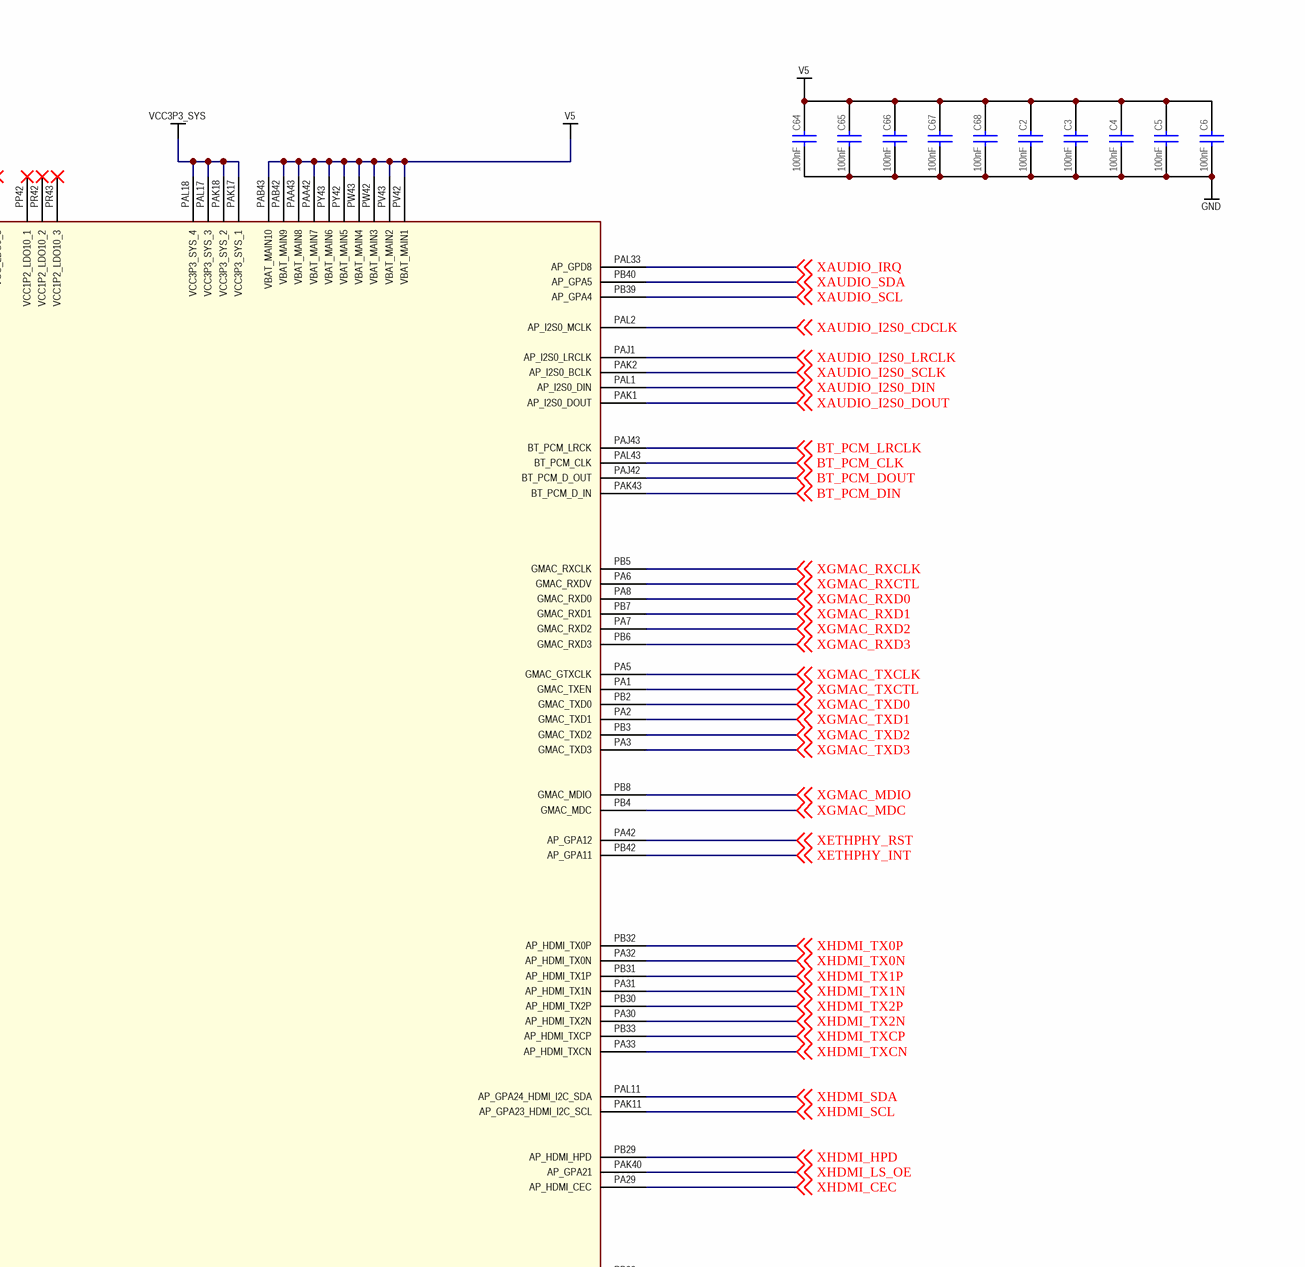
[diagram p9: 02_som.SchDoc, top right]
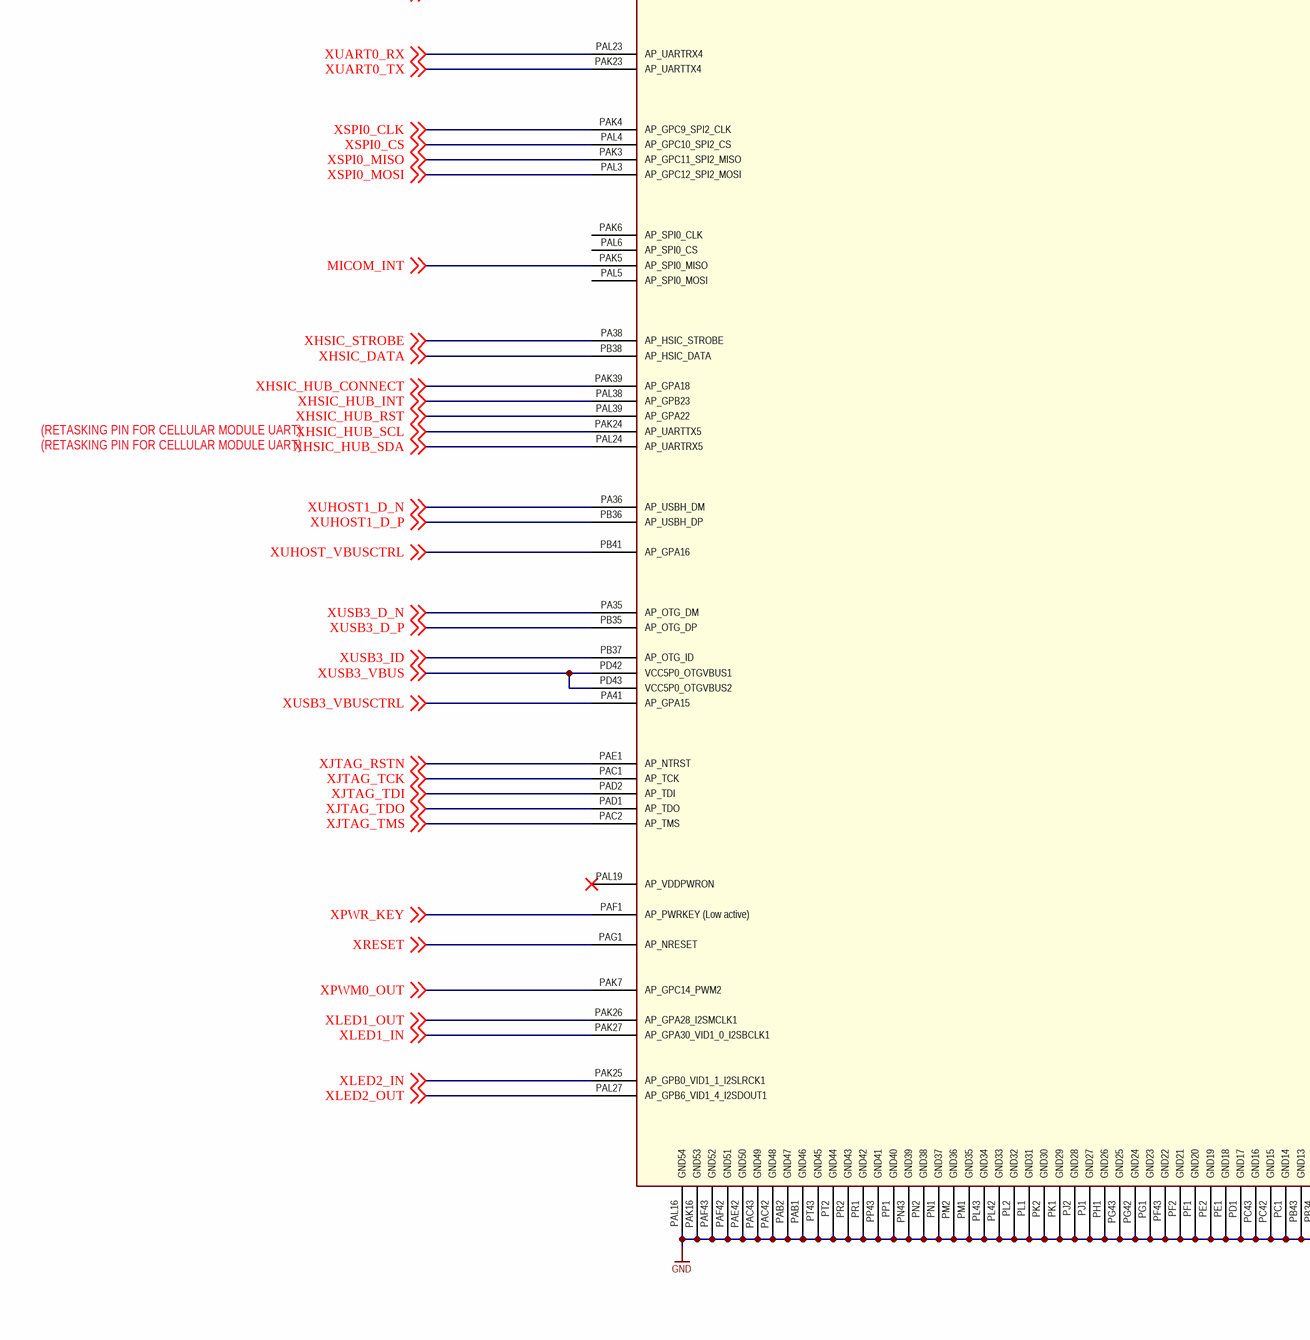
[diagram p10: 02_som.SchDoc, bottom left]
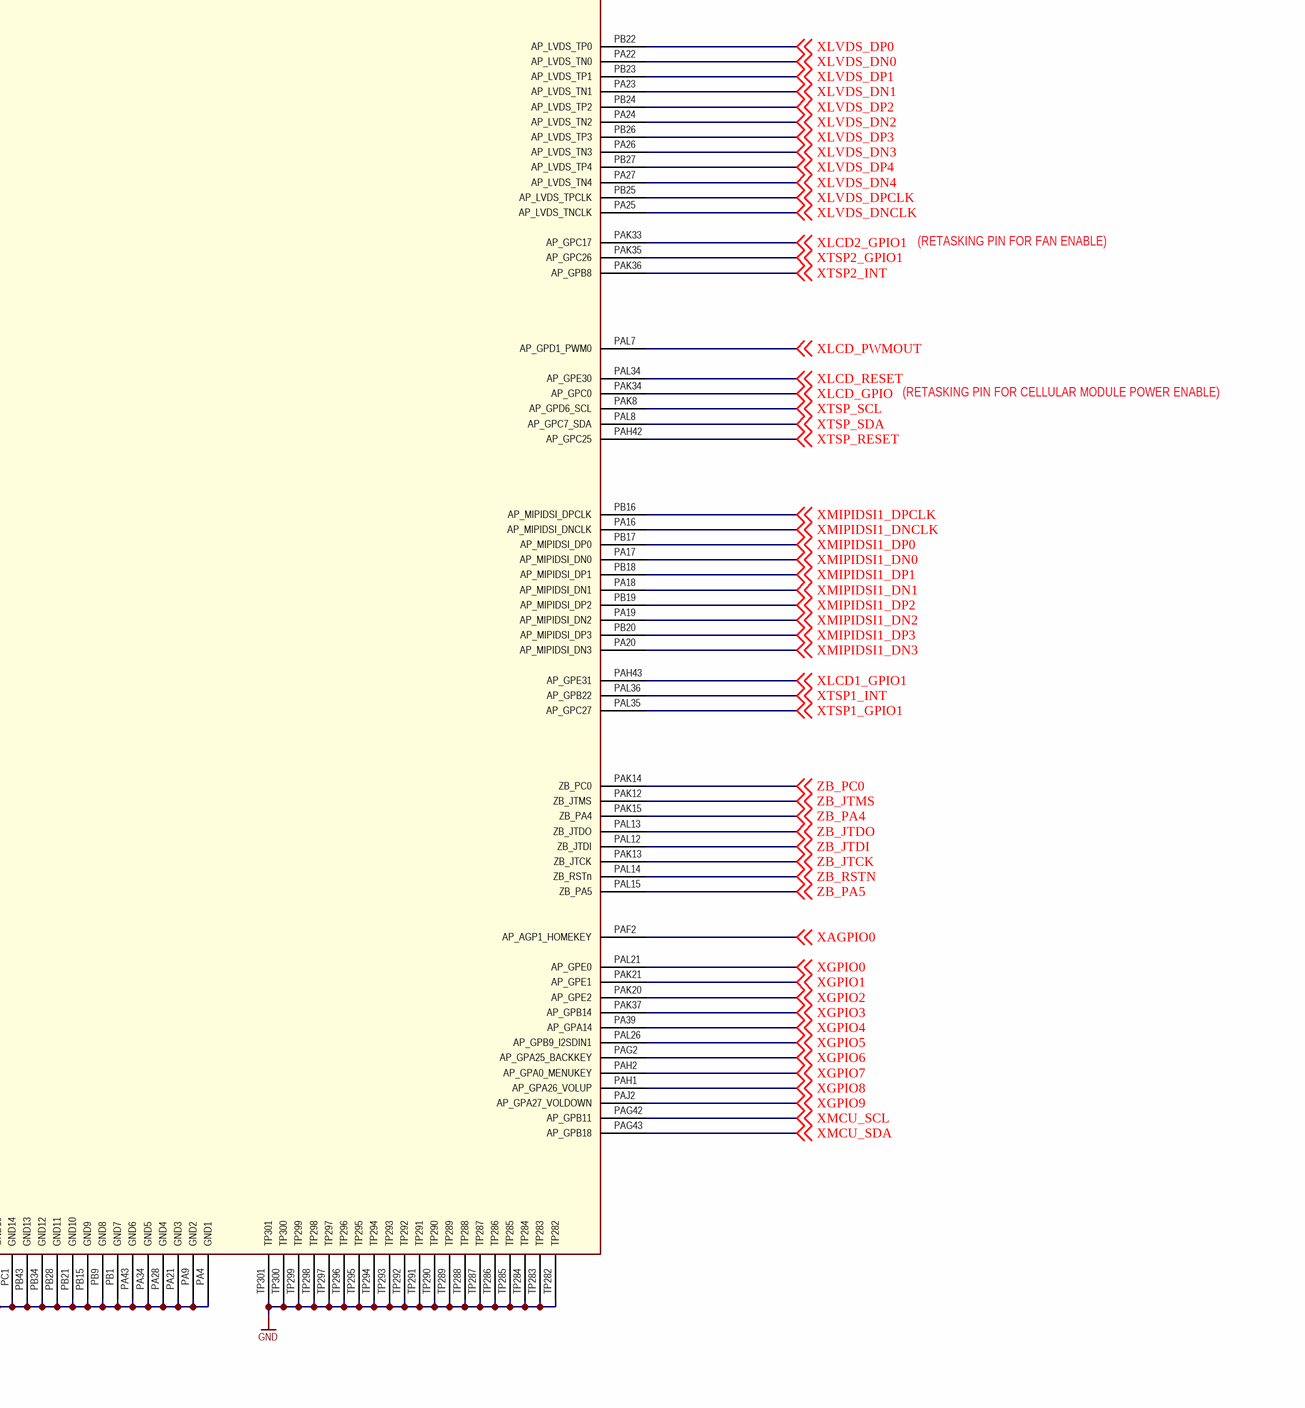
[diagram p11: 02_som.SchDoc, bottom right]

### Parts
C2  value 100nF  [CAPC100X50X55L25N]  (hidden comment: GCM155R71H104KE02)
C3  value 100nF  [CAPC100X50X55L25N]  (hidden comment: GCM155R71H104KE02)
C4  value 100nF  [CAPC100X50X55L25N]  (hidden comment: GCM155R71H104KE02)
C5  value 100nF  [CAPC100X50X55L25N]  (hidden comment: GCM155R71H104KE02)
C6  value 100nF  [CAPC100X50X55L25N]  (hidden comment: GCM155R71H104KE02)
C64  value 100nF  [CAPC100X50X55L25N]  (hidden comment: GCM155R71H104KE02)
C65  value 100nF  [CAPC100X50X55L25N]  (hidden comment: GCM155R71H104KE02)
C66  value 100nF  [CAPC100X50X55L25N]  (hidden comment: GCM155R71H104KE02)
C67  value 100nF  [CAPC100X50X55L25N]  (hidden comment: GCM155R71H104KE02)
C68  value 100nF  [CAPC100X50X55L25N]  (hidden comment: GCM155R71H104KE02)
U1  ARTIK_710_LGA_PAD  [ARTIK_LGA_PAD_10]  (value not drawn)

### Nets
GND: C2.1 C3.1 C4.1 C5.1 C6.1 C64.1 C65.1 C66.1 C67.1 C68.1 U1.PA4(GND1) U1.PA9(GND2) U1.PA21(GND3) U1.PA28(GND4) U1.PA34(GND5) U1.PA43(GND6) U1.PAB1(GND46) U1.PAB2(GND47) U1.PAC42(GND48) U1.PAC43(GND49) U1.PAE42(GND50) U1.PAF42(GND51) U1.PAF43(GND52) U1.PAK16(GND53) U1.PAL16(GND54) U1.PB1(GND7) U1.PB9(GND8) U1.PB15(GND9) U1.PB21(GND10) U1.PB28(GND11) U1.PB34(GND12) U1.PB43(GND13) U1.PC1(GND14) U1.PC42(GND15) U1.PC43(GND16) U1.PD1(GND17) U1.PE1(GND18) U1.PE2(GND19) U1.PF1(GND20) U1.PF2(GND21) U1.PF43(GND22) U1.PG1(GND23) U1.PG42(GND24) U1.PG43(GND25) U1.PH1(GND26) U1.PJ1(GND27) U1.PJ2(GND28) U1.PK1(GND29) U1.PK2(GND30) U1.PL1(GND31) U1.PL2(GND32) U1.PL42(GND33) U1.PL43(GND34) U1.PM1(GND35) U1.PM2(GND36) U1.PN1(GND37) U1.PN2(GND38) U1.PN43(GND39) U1.PP1(GND40) U1.PP43(GND41) U1.PR1(GND42) U1.PR2(GND43) U1.PT2(GND44) U1.PT43(GND45) U1.TP282 U1.TP283 U1.TP284 U1.TP285 U1.TP286 U1.TP287 U1.TP288 U1.TP289 U1.TP290 U1.TP291 U1.TP292 U1.TP293 U1.TP294 U1.TP295 U1.TP296 U1.TP297 U1.TP298 U1.TP299 U1.TP300 U1.TP301
V5: C2.2 C3.2 C4.2 C5.2 C6.2 C64.2 C65.2 C66.2 C67.2 C68.2 U1.PAA42(VBAT_MAIN7) U1.PAA43(VBAT_MAIN8) U1.PAB42(VBAT_MAIN9) U1.PAB43(VBAT_MAIN10) U1.PV42(VBAT_MAIN1) U1.PV43(VBAT_MAIN2) U1.PW42(VBAT_MAIN3) U1.PW43(VBAT_MAIN4) U1.PY42(VBAT_MAIN5) U1.PY43(VBAT_MAIN6)
VCC3P3_SYS: U1.PAK17(VCC3P3_SYS_1) U1.PAK18(VCC3P3_SYS_2) U1.PAL17(VCC3P3_SYS_3) U1.PAL18(VCC3P3_SYS_4)
XUSB3_VBUS: U1.PD42(VCC5P0_OTGVBUS1) U1.PD43(VCC5P0_OTGVBUS2) ; off-sheet XUSB3_VBUS
BT_PCM_CLK: U1.PAL43(BT_PCM_CLK) ; off-sheet BT_PCM_CLK
BT_PCM_DIN: U1.PAK43(BT_PCM_D_IN) ; off-sheet BT_PCM_DIN
BT_PCM_DOUT: U1.PAJ42(BT_PCM_D_OUT) ; off-sheet BT_PCM_DOUT
BT_PCM_LRCLK: U1.PAJ43(BT_PCM_LRCK) ; off-sheet BT_PCM_LRCLK
MICOM_INT: U1.PAK5(AP_SPI0_MISO) ; off-sheet MICOM_INT
XADC0: U1.PY1(AP_ADC0) ; off-sheet XADC0
XADC1: U1.PY2(AP_ADC1) ; off-sheet XADC1
XADC2: U1.PAA1(AP_ADC2) ; off-sheet XADC2
XADC3: U1.PAA2(AP_ADC3) ; off-sheet XADC3
XADC4: U1.PW1(AP_ADC4) ; off-sheet XADC4
XADC5: U1.PW2(AP_ADC5) ; off-sheet XADC5
XAGPIO0: U1.PAF2(AP_AGP1_HOMEKEY) ; off-sheet XAGPIO0
XAUDIO_I2S0_CDCLK: U1.PAL2(AP_I2S0_MCLK) ; off-sheet XAUDIO_I2S0_CDCLK
XAUDIO_I2S0_DIN: U1.PAL1(AP_I2S0_DIN) ; off-sheet XAUDIO_I2S0_DIN
XAUDIO_I2S0_DOUT: U1.PAK1(AP_I2S0_DOUT) ; off-sheet XAUDIO_I2S0_DOUT
XAUDIO_I2S0_LRCLK: U1.PAJ1(AP_I2S0_LRCLK) ; off-sheet XAUDIO_I2S0_LRCLK
XAUDIO_I2S0_SCLK: U1.PAK2(AP_I2S0_BCLK) ; off-sheet XAUDIO_I2S0_SCLK
XAUDIO_IRQ: U1.PAL33(AP_GPD8) ; off-sheet XAUDIO_IRQ
XAUDIO_SCL: U1.PB39(AP_GPA4) ; off-sheet XAUDIO_SCL
XAUDIO_SDA: U1.PB40(AP_GPA5) ; off-sheet XAUDIO_SDA
XBOOT_CONFIG0: U1.PAK32(AP_GPB13_SD0_BOOT) ; off-sheet XBOOT_CONFIG0
XBOOT_CONFIG1: U1.PAL32(AP_GPB15_SD1_BOOT) ; off-sheet XBOOT_CONFIG1
XBOOT_CONFIG2: U1.PAK31(AP_DISD6_BOOT) ; off-sheet XBOOT_CONFIG2
XBOOT_CONFIG3: U1.PAL31(AP_GPB4_VID1_3_BOOT) ; off-sheet XBOOT_CONFIG3
XCAM_LDO_EN: U1.PAK42(AP_GPA6) ; off-sheet XCAM_LDO_EN
XCAM_RESET: U1.PAL41(AP_GPA17) ; off-sheet XCAM_RESET
XCAM_SCL: U1.PAK10(AP_GPD2_SCL0) ; off-sheet XCAM_SCL
XCAM_SDA: U1.PAL10(AP_GPD3_SDA0) ; off-sheet XCAM_SDA
XCAM_STBY: U1.PAL42(AP_GPA3) ; off-sheet XCAM_STBY
XCHG_INT: U1.PAK41(AP_GPA10) ; off-sheet XCHG_INT
XCHG_SCL: U1.PAK38(AP_GPA20) ; off-sheet XCHG_SCL
XCHG_SDA: U1.PAL40(AP_GPA19) ; off-sheet XCHG_SDA
XDEBUG_RXD: U1.PAL22(AP_UARTRX3) ; off-sheet XDEBUG_RXD
XDEBUG_TXD: U1.PAK22(AP_UARTTX3) ; off-sheet XDEBUG_TXD
XETHPHY_INT: U1.PB42(AP_GPA11) ; off-sheet XETHPHY_INT
XETHPHY_RST: U1.PA42(AP_GPA12) ; off-sheet XETHPHY_RST
XFUEL_SCL: U1.PA40(AP_GPA9) ; off-sheet XFUEL_SCL
XFUEL_SDA: U1.PA37(AP_GPA13) ; off-sheet XFUEL_SDA
XGMAC_MDC: U1.PB4(GMAC_MDC) ; off-sheet XGMAC_MDC
XGMAC_MDIO: U1.PB8(GMAC_MDIO) ; off-sheet XGMAC_MDIO
XGMAC_RXCLK: U1.PB5(GMAC_RXCLK) ; off-sheet XGMAC_RXCLK
XGMAC_RXCTL: U1.PA6(GMAC_RXDV) ; off-sheet XGMAC_RXCTL
XGMAC_RXD0: U1.PA8(GMAC_RXD0) ; off-sheet XGMAC_RXD0
XGMAC_RXD1: U1.PB7(GMAC_RXD1) ; off-sheet XGMAC_RXD1
XGMAC_RXD2: U1.PA7(GMAC_RXD2) ; off-sheet XGMAC_RXD2
XGMAC_RXD3: U1.PB6(GMAC_RXD3) ; off-sheet XGMAC_RXD3
XGMAC_TXCLK: U1.PA5(GMAC_GTXCLK) ; off-sheet XGMAC_TXCLK
XGMAC_TXCTL: U1.PA1(GMAC_TXEN) ; off-sheet XGMAC_TXCTL
XGMAC_TXD0: U1.PB2(GMAC_TXD0) ; off-sheet XGMAC_TXD0
XGMAC_TXD1: U1.PA2(GMAC_TXD1) ; off-sheet XGMAC_TXD1
XGMAC_TXD2: U1.PB3(GMAC_TXD2) ; off-sheet XGMAC_TXD2
XGMAC_TXD3: U1.PA3(GMAC_TXD3) ; off-sheet XGMAC_TXD3
XGPIO0: U1.PAL21(AP_GPE0) ; off-sheet XGPIO0
XGPIO1: U1.PAK21(AP_GPE1) ; off-sheet XGPIO1
XGPIO2: U1.PAK20(AP_GPE2) ; off-sheet XGPIO2
XGPIO3: U1.PAK37(AP_GPB14) ; off-sheet XGPIO3
XGPIO4: U1.PA39(AP_GPA14) ; off-sheet XGPIO4
XGPIO5: U1.PAL26(AP_GPB9_I2SDIN1) ; off-sheet XGPIO5
XGPIO6: U1.PAG2(AP_GPA25_BACKKEY) ; off-sheet XGPIO6
XGPIO7: U1.PAH2(AP_GPA0_MENUKEY) ; off-sheet XGPIO7
XGPIO8: U1.PAH1(AP_GPA26_VOLUP) ; off-sheet XGPIO8
XGPIO9: U1.PAJ2(AP_GPA27_VOLDOWN) ; off-sheet XGPIO9
XHDMI_CEC: U1.PA29(AP_HDMI_CEC) ; off-sheet XHDMI_CEC
XHDMI_HPD: U1.PB29(AP_HDMI_HPD) ; off-sheet XHDMI_HPD
XHDMI_LS_OE: U1.PAK40(AP_GPA21) ; off-sheet XHDMI_LS_OE
XHDMI_SCL: U1.PAK11(AP_GPA23_HDMI_I2C_SCL) ; off-sheet XHDMI_SCL
XHDMI_SDA: U1.PAL11(AP_GPA24_HDMI_I2C_SDA) ; off-sheet XHDMI_SDA
XHDMI_TX0N: U1.PA32(AP_HDMI_TX0N) ; off-sheet XHDMI_TX0N
XHDMI_TX0P: U1.PB32(AP_HDMI_TX0P) ; off-sheet XHDMI_TX0P
XHDMI_TX1N: U1.PA31(AP_HDMI_TX1N) ; off-sheet XHDMI_TX1N
XHDMI_TX1P: U1.PB31(AP_HDMI_TX1P) ; off-sheet XHDMI_TX1P
XHDMI_TX2N: U1.PA30(AP_HDMI_TX2N) ; off-sheet XHDMI_TX2N
XHDMI_TX2P: U1.PB30(AP_HDMI_TX2P) ; off-sheet XHDMI_TX2P
XHDMI_TXCN: U1.PA33(AP_HDMI_TXCN) ; off-sheet XHDMI_TXCN
XHDMI_TXCP: U1.PB33(AP_HDMI_TXCP) ; off-sheet XHDMI_TXCP
XHSIC_DATA: U1.PB38(AP_HSIC_DATA) ; off-sheet XHSIC_DATA
XHSIC_HUB_CONNECT: U1.PAK39(AP_GPA18) ; off-sheet XHSIC_HUB_CONNECT
XHSIC_HUB_INT: U1.PAL38(AP_GPB23) ; off-sheet XHSIC_HUB_INT
XHSIC_HUB_RST: U1.PAL39(AP_GPA22) ; off-sheet XHSIC_HUB_RST
XHSIC_HUB_SCL: U1.PAK24(AP_UARTTX5) ; off-sheet XHSIC_HUB_SCL
XHSIC_HUB_SDA: U1.PAL24(AP_UARTRX5) ; off-sheet XHSIC_HUB_SDA
XHSIC_STROBE: U1.PA38(AP_HSIC_STROBE) ; off-sheet XHSIC_STROBE
XI2C0_SCL: U1.PAK9(AP_GPD4_SCL1) ; off-sheet XI2C0_SCL
XI2C0_SDA: U1.PAL9(AP_GPD5_SDA1) ; off-sheet XI2C0_SDA
XJTAG_RSTN: U1.PAE1(AP_NTRST) ; off-sheet XJTAG_RSTN
XJTAG_TCK: U1.PAC1(AP_TCK) ; off-sheet XJTAG_TCK
XJTAG_TDI: U1.PAD2(AP_TDI) ; off-sheet XJTAG_TDI
XJTAG_TDO: U1.PAD1(AP_TDO) ; off-sheet XJTAG_TDO
XJTAG_TMS: U1.PAC2(AP_TMS) ; off-sheet XJTAG_TMS
XLCD1_GPIO1: U1.PAH43(AP_GPE31) ; off-sheet XLCD1_GPIO1
XLCD2_GPIO1: U1.PAK33(AP_GPC17) ; off-sheet XLCD2_GPIO1
XLCD_GPIO: U1.PAK34(AP_GPC0) ; off-sheet XLCD_GPIO
XLCD_PWMOUT: U1.PAL7(AP_GPD1_PWM0) ; off-sheet XLCD_PWMOUT
XLCD_RESET: U1.PAL34(AP_GPE30) ; off-sheet XLCD_RESET
XLED1_IN: U1.PAK27(AP_GPA30_VID1_0_I2SBCLK1) ; off-sheet XLED1_IN
XLED1_OUT: U1.PAK26(AP_GPA28_I2SMCLK1) ; off-sheet XLED1_OUT
XLED2_IN: U1.PAK25(AP_GPB0_VID1_1_I2SLRCK1) ; off-sheet XLED2_IN
XLED2_OUT: U1.PAL27(AP_GPB6_VID1_4_I2SDOUT1) ; off-sheet XLED2_OUT
XLVDS_DN0: U1.PA22(AP_LVDS_TN0) ; off-sheet XLVDS_DN0
XLVDS_DN1: U1.PA23(AP_LVDS_TN1) ; off-sheet XLVDS_DN1
XLVDS_DN2: U1.PA24(AP_LVDS_TN2) ; off-sheet XLVDS_DN2
XLVDS_DN3: U1.PA26(AP_LVDS_TN3) ; off-sheet XLVDS_DN3
XLVDS_DN4: U1.PA27(AP_LVDS_TN4) ; off-sheet XLVDS_DN4
XLVDS_DNCLK: U1.PA25(AP_LVDS_TNCLK) ; off-sheet XLVDS_DNCLK
XLVDS_DP0: U1.PB22(AP_LVDS_TP0) ; off-sheet XLVDS_DP0
XLVDS_DP1: U1.PB23(AP_LVDS_TP1) ; off-sheet XLVDS_DP1
XLVDS_DP2: U1.PB24(AP_LVDS_TP2) ; off-sheet XLVDS_DP2
XLVDS_DP3: U1.PB26(AP_LVDS_TP3) ; off-sheet XLVDS_DP3
XLVDS_DP4: U1.PB27(AP_LVDS_TP4) ; off-sheet XLVDS_DP4
XLVDS_DPCLK: U1.PB25(AP_LVDS_TPCLK) ; off-sheet XLVDS_DPCLK
XMCU_SCL: U1.PAG42(AP_GPB11) ; off-sheet XMCU_SCL
XMCU_SDA: U1.PAG43(AP_GPB18) ; off-sheet XMCU_SDA
XMIPICSI1_DN0: U1.PA11(AP_MIPICSI_DN0) ; off-sheet XMIPICSI1_DN0
XMIPICSI1_DN1: U1.PA12(AP_MIPICSI_DN1) ; off-sheet XMIPICSI1_DN1
XMIPICSI1_DN2: U1.PA13(AP_MIPICSI_DN2) ; off-sheet XMIPICSI1_DN2
XMIPICSI1_DN3: U1.PA14(AP_MIPICSI_DN3) ; off-sheet XMIPICSI1_DN3
XMIPICSI1_DNCLK: U1.PA10(AP_MIPICSI_DNCLK) ; off-sheet XMIPICSI1_DNCLK
XMIPICSI1_DP0: U1.PB11(AP_MIPICSI_DP0) ; off-sheet XMIPICSI1_DP0
XMIPICSI1_DP1: U1.PB12(AP_MIPICSI_DP1) ; off-sheet XMIPICSI1_DP1
XMIPICSI1_DP2: U1.PB13(AP_MIPICSI_DP2) ; off-sheet XMIPICSI1_DP2
XMIPICSI1_DP3: U1.PB14(AP_MIPICSI_DP3) ; off-sheet XMIPICSI1_DP3
XMIPICSI1_DPCLK: U1.PB10(AP_MIPICSI_DPCLK) ; off-sheet XMIPICSI1_DPCLK
XMIPIDSI1_DN0: U1.PA17(AP_MIPIDSI_DN0) ; off-sheet XMIPIDSI1_DN0
XMIPIDSI1_DN1: U1.PA18(AP_MIPIDSI_DN1) ; off-sheet XMIPIDSI1_DN1
XMIPIDSI1_DN2: U1.PA19(AP_MIPIDSI_DN2) ; off-sheet XMIPIDSI1_DN2
XMIPIDSI1_DN3: U1.PA20(AP_MIPIDSI_DN3) ; off-sheet XMIPIDSI1_DN3
XMIPIDSI1_DNCLK: U1.PA16(AP_MIPIDSI_DNCLK) ; off-sheet XMIPIDSI1_DNCLK
XMIPIDSI1_DP0: U1.PB17(AP_MIPIDSI_DP0) ; off-sheet XMIPIDSI1_DP0
XMIPIDSI1_DP1: U1.PB18(AP_MIPIDSI_DP1) ; off-sheet XMIPIDSI1_DP1
XMIPIDSI1_DP2: U1.PB19(AP_MIPIDSI_DP2) ; off-sheet XMIPIDSI1_DP2
XMIPIDSI1_DP3: U1.PB20(AP_MIPIDSI_DP3) ; off-sheet XMIPIDSI1_DP3
XMIPIDSI1_DPCLK: U1.PB16(AP_MIPIDSI_DPCLK) ; off-sheet XMIPIDSI1_DPCLK
XPWM0_OUT: U1.PAK7(AP_GPC14_PWM2) ; off-sheet XPWM0_OUT
XPWR_KEY: U1.PAF1(AP_PWRKEY_(Low_active)) ; off-sheet XPWR_KEY
XRESET: U1.PAG1(AP_NRESET) ; off-sheet XRESET
XRTC_INT: U1.PAE2(AP_AGP2_RTC_INT_N) ; off-sheet XRTC_INT
XRTC_SCL: U1.PAL20(AP_GPE3) ; off-sheet XRTC_SCL
XRTC_SDA: U1.PAL25(AP_GPD31) ; off-sheet XRTC_SDA
XSD0_CDN: U1.PAL37(AP_GPB16) ; off-sheet XSD0_CDN
XSD0_CLK: U1.PAK30(AP_SD0_CLK) ; off-sheet XSD0_CLK
XSD0_CMD: U1.PAK28(AP_SD0_CMD) ; off-sheet XSD0_CMD
XSD0_D0: U1.PAL30(AP_SD0_D0) ; off-sheet XSD0_D0
XSD0_D1: U1.PAK29(AP_SD0_D1) ; off-sheet XSD0_D1
XSD0_D2: U1.PAL29(AP_SD0_D2) ; off-sheet XSD0_D2
XSD0_D3: U1.PAL28(AP_SD0_D3) ; off-sheet XSD0_D3
XSPI0_CLK: U1.PAK4(AP_GPC9_SPI2_CLK) ; off-sheet XSPI0_CLK
XSPI0_CS: U1.PAL4(AP_GPC10_SPI2_CS) ; off-sheet XSPI0_CS
XSPI0_MISO: U1.PAK3(AP_GPC11_SPI2_MISO) ; off-sheet XSPI0_MISO
XSPI0_MOSI: U1.PAL3(AP_GPC12_SPI2_MOSI) ; off-sheet XSPI0_MOSI
XTSP1_GPIO1: U1.PAL35(AP_GPC27) ; off-sheet XTSP1_GPIO1
XTSP1_INT: U1.PAL36(AP_GPB22) ; off-sheet XTSP1_INT
XTSP2_GPIO1: U1.PAK35(AP_GPC26) ; off-sheet XTSP2_GPIO1
XTSP2_INT: U1.PAK36(AP_GPB8) ; off-sheet XTSP2_INT
XTSP_RESET: U1.PAH42(AP_GPC25) ; off-sheet XTSP_RESET
XTSP_SCL: U1.PAK8(AP_GPD6_SCL) ; off-sheet XTSP_SCL
XTSP_SDA: U1.PAL8(AP_GPC7_SDA) ; off-sheet XTSP_SDA
XUART0_RX: U1.PAL23(AP_UARTRX4) ; off-sheet XUART0_RX
XUART0_TX: U1.PAK23(AP_UARTTX4) ; off-sheet XUART0_TX
XUHOST1_D_N: U1.PA36(AP_USBH_DM) ; off-sheet XUHOST1_D_N
XUHOST1_D_P: U1.PB36(AP_USBH_DP) ; off-sheet XUHOST1_D_P
XUHOST_VBUSCTRL: U1.PB41(AP_GPA16) ; off-sheet XUHOST_VBUSCTRL
XUSB3_D_N: U1.PA35(AP_OTG_DM) ; off-sheet XUSB3_D_N
XUSB3_D_P: U1.PB35(AP_OTG_DP) ; off-sheet XUSB3_D_P
XUSB3_ID: U1.PB37(AP_OTG_ID) ; off-sheet XUSB3_ID
XUSB3_VBUSCTRL: U1.PA41(AP_GPA15) ; off-sheet XUSB3_VBUSCTRL
ZB_JTCK: U1.PAK13(ZB_JTCK) ; off-sheet ZB_JTCK
ZB_JTDI: U1.PAL12(ZB_JTDI) ; off-sheet ZB_JTDI
ZB_JTDO: U1.PAL13(ZB_JTDO) ; off-sheet ZB_JTDO
ZB_JTMS: U1.PAK12(ZB_JTMS) ; off-sheet ZB_JTMS
ZB_PA4: U1.PAK15(ZB_PA4) ; off-sheet ZB_PA4
ZB_PA5: U1.PAL15(ZB_PA5) ; off-sheet ZB_PA5
ZB_PC0: U1.PAK14(ZB_PC0) ; off-sheet ZB_PC0
ZB_RSTN: U1.PAL14(ZB_RSTn) ; off-sheet ZB_RSTN

Not connected (* = marked no-connect by the designer): U1 PAD42(VCC3V3_LDO8_1)* PAD43(VCC3V3_LDO8_2)* PAE43(VCC3V3_LDO8_3)* PAK6(AP_SPI0_CLK) PAK19(AP_NBATTF)* PAL5(AP_SPI0_MOSI) PAL6(AP_SPI0_CS) PAL19(AP_VDDPWRON)* PE42(VCC2P8_LDO7_1)* PE43(VCC2P8_LDO7_2)* PF42(VCC2P8_LDO7_3)* PH42(VCC_LDO5_1)* PH43(VCC_LDO5_2)* PJ42(VCC_LDO5_3)* PJ43(VCC_LDO2_1)* PK42(VCC_LDO2_2)* PK43(VCC_LDO2_3)* PM42(VCC_LDO1_1)* PM43(VCC_LDO1_2)* PN42(VCC_LDO1_3)* PP42(VCC1P2_LDO10_1)* PR42(VCC1P2_LDO10_2)* PR43(VCC1P2_LDO10_3)* PT1(VCC1P8_LDO4_1)* PT42(VCC_LDO9_1)* PU1(VCC_1P8_LDO4_2)* PU42(VCC_LDO9_2)* PU43(VCC_LDO9_3)* PV1(VCC1P8_LDO4_3)*

### Notes on the sheet
- (RETASKING PIN FOR FAN ENABLE)
- (RETASKING PIN FOR CELLULAR MODULE POWER ENABLE)
- (RETASKING PIN FOR CELLULAR MODULE UART)
- Title
- Engineer
- Revision
- Drawn By
- Sheet
- of
- Checked By
- Date

### Library data of the parts
C2-C6 C64-C68 = CAP: as C34 on sheet 01_main; Manufacturer P/N: GCM155R71H104KE02; Tolerance: ±10%; Voltage: 50V; Footprint: *; Package: 0402
U1 = ARTIK_LGA_PAD_10: ARTIK 710 System on Module; Manufacturer: Samsung; Manufacturer P/N: Artik 710

## Sheet 04_ethernet.SchDoc
size D; CompanyName: Signal Laboratories, Inc.; Address1: 3479 Edison Way; Address2: Menlo Park CA 94025; Address3: +1 (877) 778-8435; Address4: siglabs.com; Revision: 1; SheetNumber: 1; SheetTotal: 1
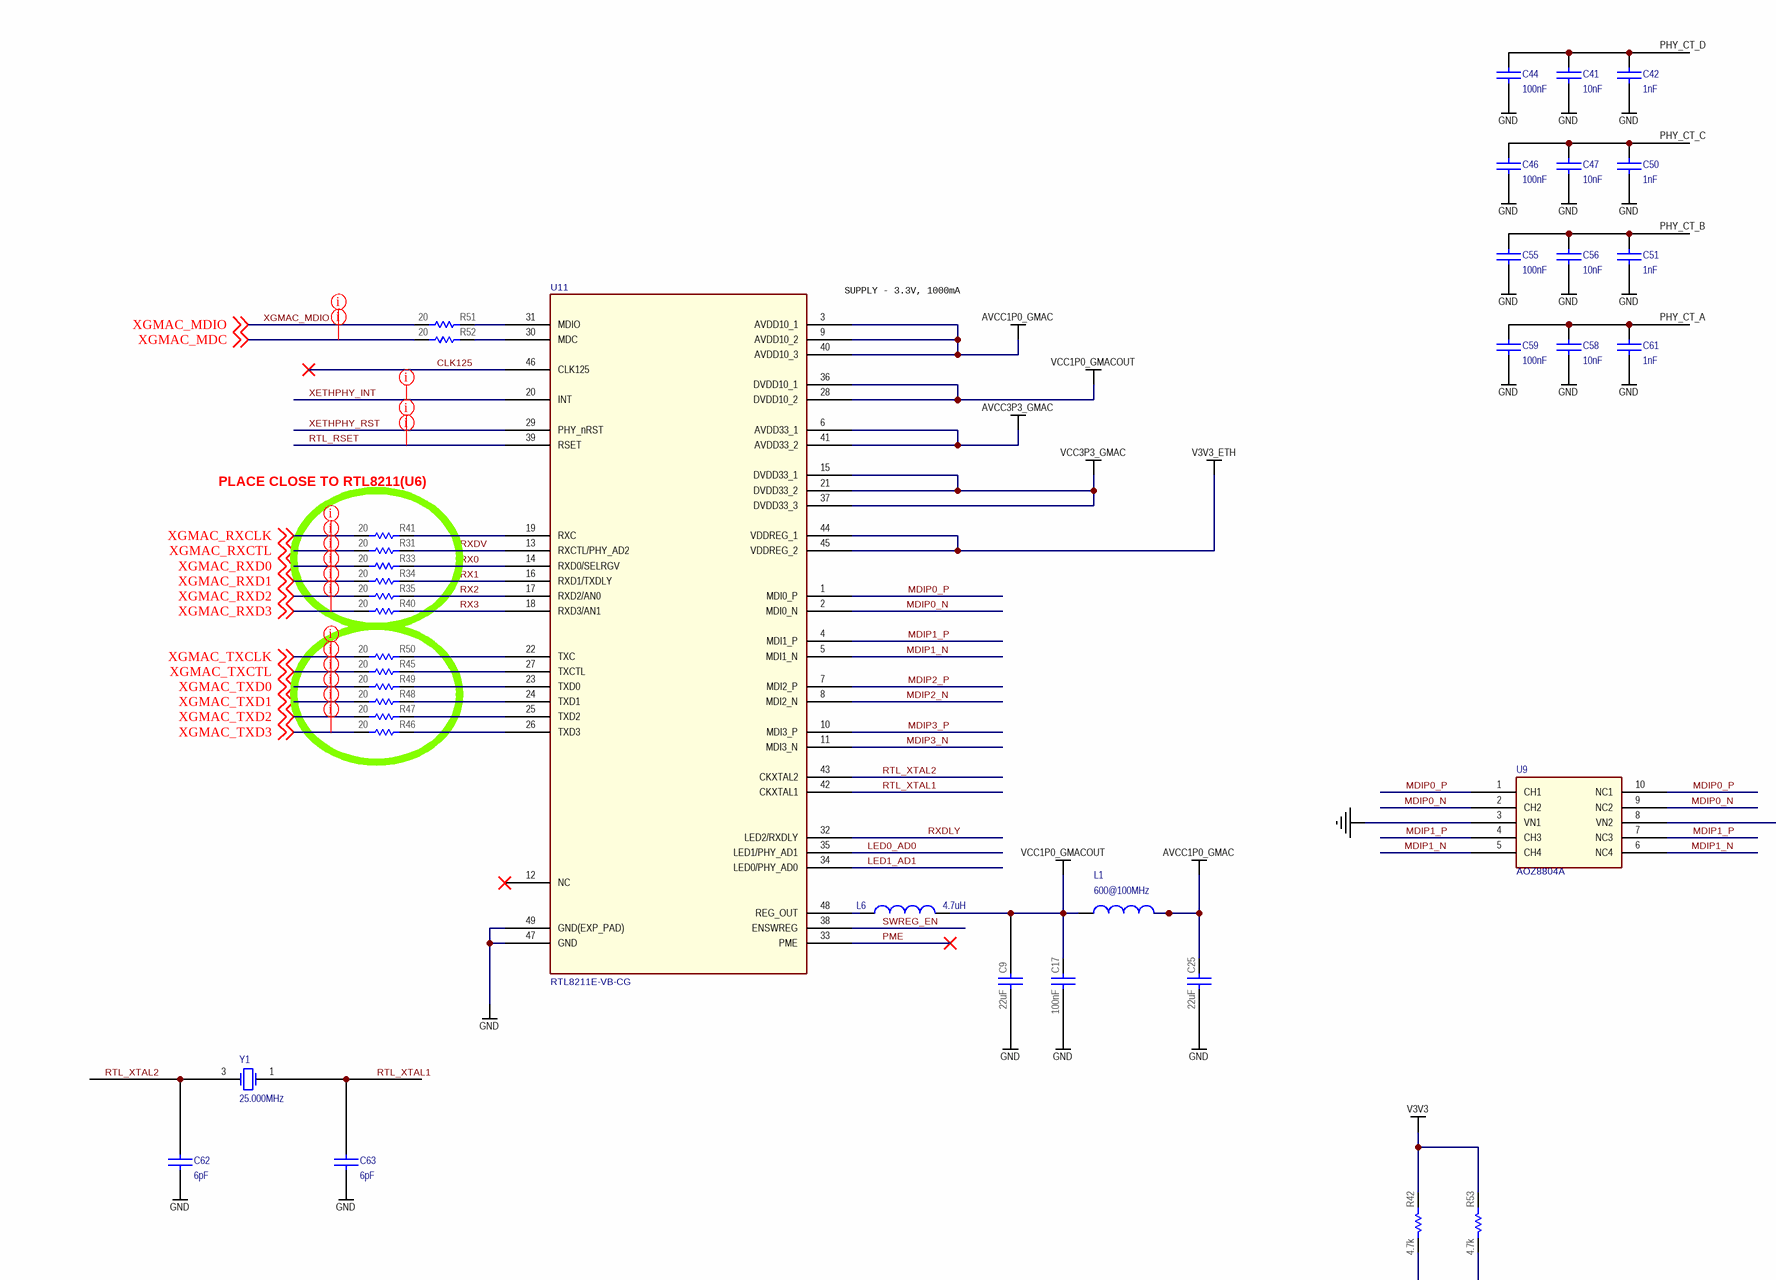
[diagram p12: 04_ethernet.SchDoc, top left]
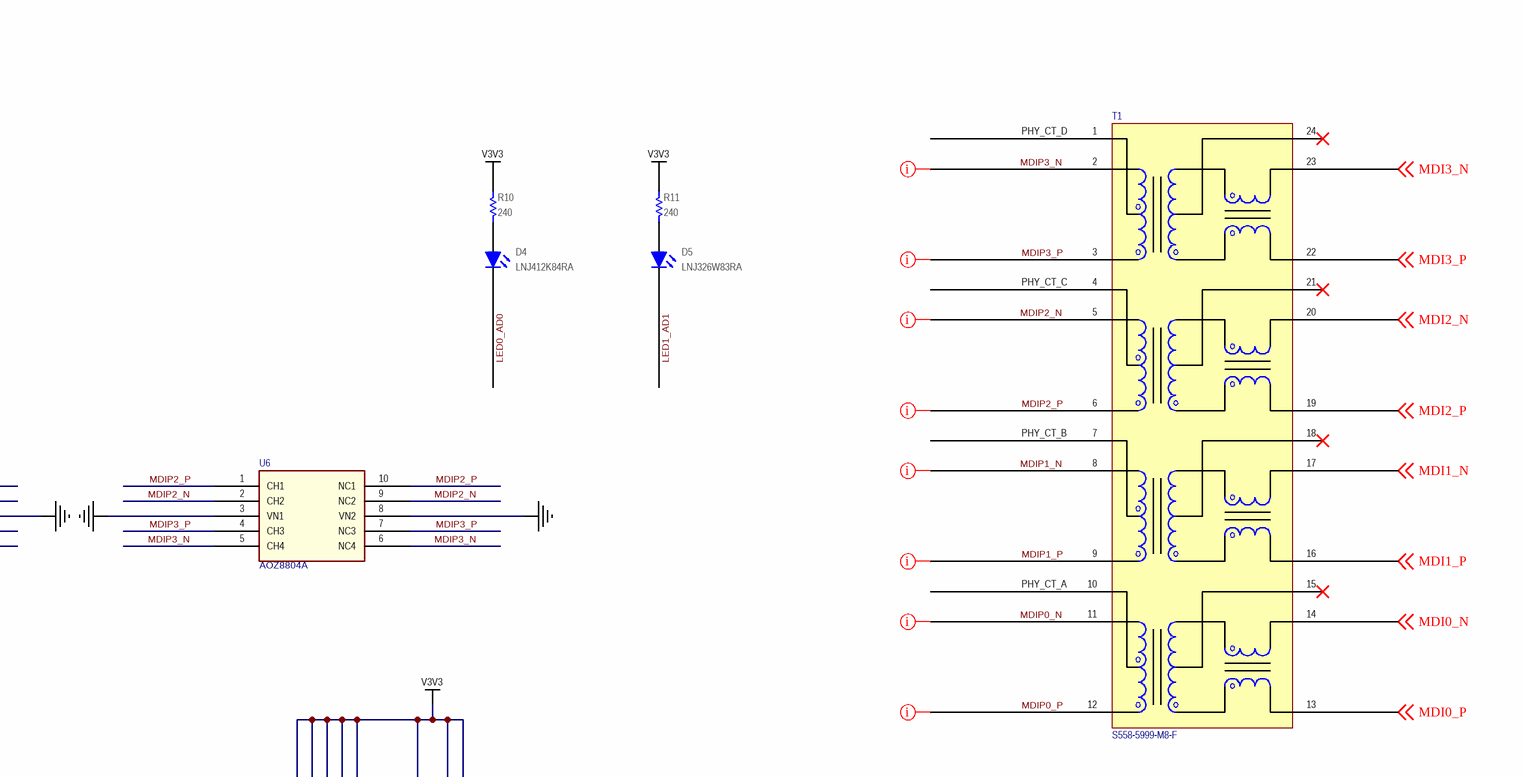
[diagram p13: 04_ethernet.SchDoc, top right]
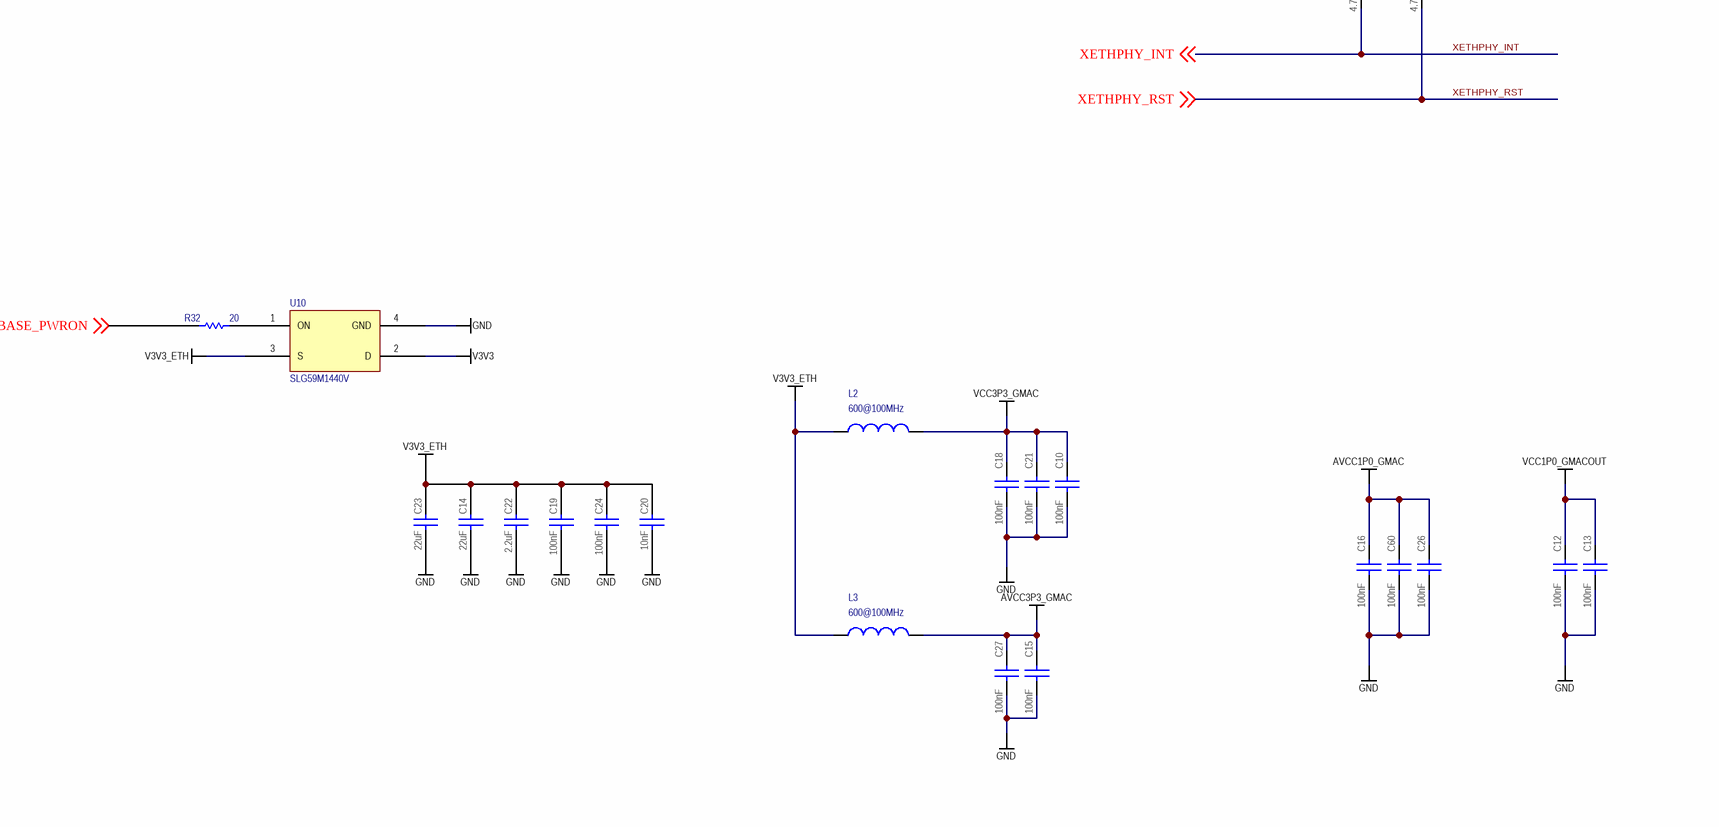
[diagram p14: 04_ethernet.SchDoc, bottom left]
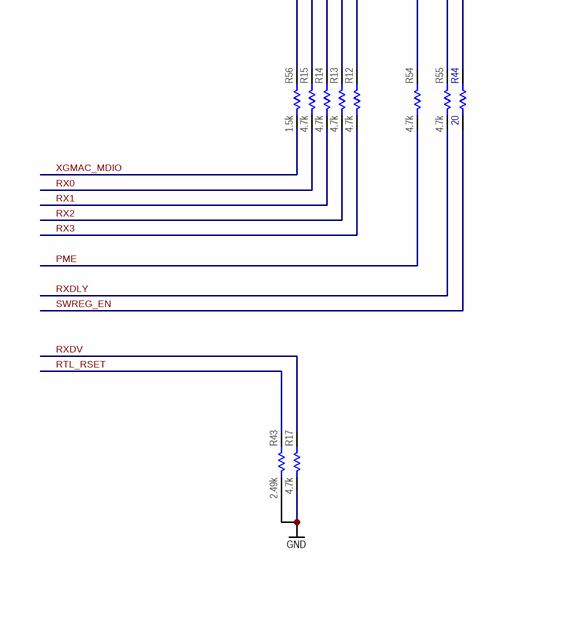
[diagram p15: 04_ethernet.SchDoc, bottom right]

### Parts
C9  value 22uF  [CAPC200X125X145L45N]  (hidden comment: C2012X7S1A226M125)
C10  value 100nF  [CAPC100X50X55L25N]  (hidden comment: GCM155R71H104KE02)
C12  value 100nF  [CAPC100X50X55L25N]  (hidden comment: GCM155R71H104KE02)
C13  value 100nF  [CAPC100X50X55L25N]  (hidden comment: GCM155R71H104KE02)
C14  value 22uF  [CAPC200X125X145L45N]  (hidden comment: C2012X7S1A226M125)
C15  value 100nF  [CAPC100X50X55L25N]  (hidden comment: GCM155R71H104KE02)
C16  value 100nF  [CAPC100X50X55L25N]  (hidden comment: GCM155R71H104KE02)
C17  value 100nF  [CAPC100X50X55L25N]  (hidden comment: GCM155R71H104KE02)
C18  value 100nF  [CAPC100X50X55L25N]  (hidden comment: GCM155R71H104KE02)
C19  value 100nF  [CAPC100X50X55L25N]  (hidden comment: GCM155R71H104KE02)
C20  value 10nF  [CAPC100X50X55L25N]  (hidden comment: GRM155R71H103KA88)
C21  value 100nF  [CAPC100X50X55L25N]  (hidden comment: GCM155R71H104KE02)
C22  value 2.2uF  [CAPC160X80X90L20N]  (hidden comment: C1608X7R1A225M080)
C23  value 22uF  [CAPC200X125X145L45N]  (hidden comment: C2012X7S1A226M125)
C24  value 100nF  [CAPC100X50X55L25N]  (hidden comment: GCM155R71H104KE02)
C25  value 22uF  [CAPC200X125X145L45N]  (hidden comment: C2012X7S1A226M125)
C26  value 100nF  [CAPC100X50X55L25N]  (hidden comment: GCM155R71H104KE02)
C27  value 100nF  [CAPC100X50X55L25N]  (hidden comment: GCM155R71H104KE02)
C41  value 10nF  [0402]  (hidden comment: GRM155R71E103KA01D)
C42  value 1nF  [0402]  (hidden comment: GRM1555C1H102JA01D)
C44  value 100nF  [0402]  (hidden comment: GRM155R71C104KA88J)
C46  value 100nF  [0402]  (hidden comment: GRM155R71C104KA88J)
C47  value 10nF  [0402]  (hidden comment: GRM155R71E103KA01D)
C50  value 1nF  [0402]  (hidden comment: GRM1555C1H102JA01D)
C51  value 1nF  [0402]  (hidden comment: GRM1555C1H102JA01D)
C55  value 100nF  [0402]  (hidden comment: GRM155R71C104KA88J)
C56  value 10nF  [0402]  (hidden comment: GRM155R71E103KA01D)
C58  value 10nF  [0402]  (hidden comment: GRM155R71E103KA01D)
C59  value 100nF  [0402]  (hidden comment: GRM155R71C104KA88J)
C60  value 100nF  [CAPC100X50X55L25N]  (hidden comment: GCM155R71H104KE02)
C61  value 1nF  [0402]  (hidden comment: GRM1555C1H102JA01D)
C62  value 6pF  [0402]  (hidden comment: GJM1555C1H6R0CB01D)
C63  value 6pF  [0402]  (hidden comment: GJM1555C1H6R0CB01D)
D4  LNJ412K84RA  [0603_LED]
D5  LNJ326W83RA  [0603_LED]
L1  value 600@100MHz  [INDC1005X55N]  (hidden comment: BLM15PX601SN1D)
L2  value 600@100MHz  [INDC1005X55N]  (hidden comment: BLM15PX601SN1D)
L3  value 600@100MHz  [INDC1005X55N]  (hidden comment: BLM15PX601SN1D)
L6  value 4.7uH  [INDC200X125X105L50N]  (hidden comment: CIG21L4R7MNE)
R10  value 240  [RESC1005X40N]  (hidden comment: ERJ-2RKF2400X)
R11  value 240  [RESC1005X40N]  (hidden comment: ERJ-2RKF2400X)
R12  value 4.7k  [RESC1005X40N]  (hidden comment: ERJ-2RKF4701X)
R13  value 4.7k  [RESC1005X40N]  (hidden comment: ERJ-2RKF4701X)
R14  value 4.7k  [RESC1005X40N]  (hidden comment: ERJ-2RKF4701X)
R15  value 4.7k  [RESC1005X40N]  (hidden comment: ERJ-2RKF4701X)
R17  value 4.7k  [RESC1005X40N]  (hidden comment: ERJ-2RKF4701X)
R31  value 20  [RESC1005X40N]  (hidden comment: ERJ-2RKF20R0X)
R32  value 20  [0402]  (hidden comment: ERJ-2RKF20R0X)
R33  value 20  [RESC1005X40N]  (hidden comment: ERJ-2RKF20R0X)
R34  value 20  [RESC1005X40N]  (hidden comment: ERJ-2RKF20R0X)
R35  value 20  [RESC1005X40N]  (hidden comment: ERJ-2RKF20R0X)
R40  value 20  [RESC1005X40N]  (hidden comment: ERJ-2RKF20R0X)
R41  value 20  [RESC1005X40N]  (hidden comment: ERJ-2RKF20R0X)
R42  value 4.7k  [RESC1005X40N]  (hidden comment: ERJ-2RKF4701X)
R43  value 2.49k  [RESC1005X40N]  (hidden comment: ERJ-2RKF2491X)
R44  value 20  [0402]  (hidden comment: ERJ-2RKF20R0X)
R45  value 20  [RESC1005X40N]  (hidden comment: ERJ-2RKF20R0X)
R46  value 20  [RESC1005X40N]  (hidden comment: ERJ-2RKF20R0X)
R47  value 20  [RESC1005X40N]  (hidden comment: ERJ-2RKF20R0X)
R48  value 20  [RESC1005X40N]  (hidden comment: ERJ-2RKF20R0X)
R49  value 20  [RESC1005X40N]  (hidden comment: ERJ-2RKF20R0X)
R50  value 20  [RESC1005X40N]  (hidden comment: ERJ-2RKF20R0X)
R51  value 20  [RESC1005X40N]  (hidden comment: ERJ-2RKF20R0X)
R52  value 20  [RESC1005X40N]  (hidden comment: ERJ-2RKF20R0X)
R53  value 4.7k  [RESC1005X40N]  (hidden comment: ERJ-2RKF4701X)
R54  value 4.7k  [RESC1005X40N]  (hidden comment: ERJ-2RKF4701X)
R55  value 4.7k  [RESC1005X40N]  (hidden comment: ERJ-2RKF4701X)
R56  value 1.5k  [RESC1005X40N]  (hidden comment: ERJ-2RKF1501X)
T1  S558-5999-M8-F  [SOIC127P1524X571-24N]
U6  AOZ8804A  [AOZ8804]
U9  AOZ8804A  [AOZ8804]
U10  SLG59M1440V  [SLG59M1440V]
U11  RTL8211E-VB-CG  [QFN48]
Y1  Freq: 25.000MHz  [XRCGB]  (hidden comment: XRCGB25M000F3N00R0)

### Nets
AVCC1P0_GMAC: C16.2 C25.2 C26.2 C60.2 L1.2 U11.3(AVDD10_1) U11.9(AVDD10_2) U11.40(AVDD10_3)
AVCC3P3_GMAC: C15.2 C27.2 L3.2 U11.6(AVDD33_1) U11.41(AVDD33_2)
GND: C9.1 C10.1 C12.1 C13.1 C14.1 C15.1 C16.1 C17.1 C18.1 C19.1 C20.2 C21.1 C22.1 C23.1 C24.1 C25.1 C26.1 C27.1 C41.1 C42.1 C44.1 C46.1 C47.1 C50.1 C51.1 C55.1 C56.1 C58.1 C59.1 C60.1 C61.1 C62.1 C63.1 R17.1 R43.2 U6.3(VN1) U6.8(VN2) U9.3(VN1) U9.8(VN2) U10.4(GND) U11.47(GND) U11.49(GND(EXP_PAD))
V3V3: R10.1 R11.1 R12.2 R13.2 R14.2 R15.2 R42.2 R44.1 R53.2 R54.2 R55.2 R56.1 U10.2(D)
V3V3_ETH: C14.2 C19.2 C20.1 C22.2 C23.2 C24.2 L2.1 L3.1 U10.3(S) U11.44(VDDREG_1) U11.45(VDDREG_2)
VCC1P0_GMACOUT: C9.2 C12.2 C13.2 C17.2 L1.1 L6.2 U11.28(DVDD10_2) U11.36(DVDD10_1)
VCC3P3_GMAC: C10.2 C18.2 C21.2 L2.2 U11.15(DVDD33_1) U11.21(DVDD33_2) U11.37(DVDD33_3)
CLK125: U11.46(CLK125)
LED0_AD0: D4.2(K) U11.35(LED1/PHY_AD1)
LED1_AD1: D5.2(K) U11.34(LED0/PHY_AD0)
MDI0_N: T1.14(TXONA) ; off-sheet MDI0_N
MDI0_P: T1.13(TXOPA) ; off-sheet MDI0_P
MDI1_N: T1.17(TXONB) ; off-sheet MDI1_N
MDI1_P: T1.16(TXOPB) ; off-sheet MDI1_P
MDI2_N: T1.20(TXONC) ; off-sheet MDI2_N
MDI2_P: T1.19(TXOPC) ; off-sheet MDI2_P
MDI3_N: T1.23(TXOND) ; off-sheet MDI3_N
MDI3_P: T1.22(TXOPD) ; off-sheet MDI3_P
MDIP0_N: T1.11(TPONA) U9.2(CH2) U9.9(NC2) U11.2(MDI0_N)
MDIP0_P: T1.12(TPOPA) U9.1(CH1) U9.10(NC1) U11.1(MDI0_P)
MDIP1_N: T1.8(TPONB) U9.5(CH4) U9.6(NC4) U11.5(MDI1_N)
MDIP1_P: T1.9(TPOPB) U9.4(CH3) U9.7(NC3) U11.4(MDI1_P)
MDIP2_N: T1.5(TPONC) U6.2(CH2) U6.9(NC2) U11.8(MDI2_N)
MDIP2_P: T1.6(TPOPC) U6.1(CH1) U6.10(NC1) U11.7(MDI2_P)
MDIP3_N: T1.2(TPOND) U6.5(CH4) U6.6(NC4) U11.11(MDI3_N)
MDIP3_P: T1.3(TPOPD) U6.4(CH3) U6.7(NC3) U11.10(MDI3_P)
PHY_CT_A: C58.2 C59.2 C61.2 T1.10(TCTA)
PHY_CT_B: C51.2 C55.2 C56.2 T1.7(TCTB)
PHY_CT_C: C46.2 C47.2 C50.2 T1.4(TCTC)
PHY_CT_D: C41.2 C42.2 C44.2 T1.1(TCTD)
PME: R54.1 U11.33(PME)
RTL_RSET: R43.1 U11.39(RSET)
RTL_XTAL1: C63.2 U11.42(CKXTAL1) Y1.1(OSC1)
RTL_XTAL2: C62.2 U11.43(CKXTAL2) Y1.3(OSC2)
RX0: R15.1 R33.2 U11.14(RXD0/SELRGV)
RX1: R14.1 R34.2 U11.16(RXD1/TXDLY)
RX2: R13.1 R35.2 U11.17(RXD2/AN0)
RX3: R12.1 R40.2 U11.18(RXD3/AN1)
RXDLY: R55.1 U11.32(LED2/RXDLY)
RXDV: R17.2 R31.2 U11.13(RXCTL/PHY_AD2)
SWREG_EN: R44.2 U11.38(ENSWREG)
XBASE_PWRON: R32.2 ; off-sheet XBASE_PWRON
XETHPHY_INT: R42.1 U11.20(INT) ; off-sheet XETHPHY_INT
XETHPHY_RST: R53.1 U11.29(PHY_nRST) ; off-sheet XETHPHY_RST
XGMAC_MDC: R52.1 ; off-sheet XGMAC_MDC
XGMAC_MDIO: R51.1 R56.2 ; off-sheet XGMAC_MDIO
XGMAC_RXCLK: R41.1 ; off-sheet XGMAC_RXCLK
XGMAC_RXCTL: R31.1 ; off-sheet XGMAC_RXCTL
XGMAC_RXD0: R33.1 ; off-sheet XGMAC_RXD0
XGMAC_RXD1: R34.1 ; off-sheet XGMAC_RXD1
XGMAC_RXD2: R35.1 ; off-sheet XGMAC_RXD2
XGMAC_RXD3: R40.1 ; off-sheet XGMAC_RXD3
XGMAC_TXCLK: R50.1 ; off-sheet XGMAC_TXCLK
XGMAC_TXCTL: R45.1 ; off-sheet XGMAC_TXCTL
XGMAC_TXD0: R49.1 ; off-sheet XGMAC_TXD0
XGMAC_TXD1: R48.1 ; off-sheet XGMAC_TXD1
XGMAC_TXD2: R47.1 ; off-sheet XGMAC_TXD2
XGMAC_TXD3: R46.1 ; off-sheet XGMAC_TXD3
NetD4_1: D4.1(A) R10.2
NetD5_1: D5.1(A) R11.2
NetL6_1: L6.1 U11.48(REG_OUT)
NetR32_1: R32.1 U10.1(ON)
NetR41_2: R41.2 U11.19(RXC)
NetR45_2: R45.2 U11.27(TXCTL)
NetR46_2: R46.2 U11.26(TXD3)
NetR47_2: R47.2 U11.25(TXD2)
NetR48_2: R48.2 U11.24(TXD1)
NetR49_2: R49.2 U11.23(TXD0)
NetR50_2: R50.2 U11.22(TXC)
NetR51_2: R51.2 U11.31(MDIO)
NetR52_2: R52.2 U11.30(MDC)

Not connected (* = marked no-connect by the designer): T1 15(TXTA)* 18(TXTB)* 21(TXTC)* 24(TXTD)*; U11 12(NC)*; Y1 2(NC) 4(NC)

### Layout directives
net class ETH: MDIP0_N, MDIP0_P, MDIP1_N, MDIP1_P, MDIP2_N, MDIP2_P, MDIP3_N, MDIP3_P
net class MAC: RTL_RSET, XETHPHY_INT, XETHPHY_RST, XGMAC_MDC, XGMAC_MDIO, XGMAC_RXCLK, XGMAC_RXCTL, XGMAC_RXD0, XGMAC_RXD1, XGMAC_RXD2, XGMAC_RXD3, XGMAC_TXCLK, XGMAC_TXCTL, XGMAC_TXD0, XGMAC_TXD1, XGMAC_TXD2, XGMAC_TXD3

### Notes on the sheet
- (near U11) SUPPLY - 3.3V, 1000mA
- PLACE CLOSE TO RTL8211(U6)
- Title
- Engineer
- Revision
- Drawn By
- Sheet
- of
- Checked By
- Date

### Library data of the parts
C9 C14 C23 C25 = CAP: as C33 on sheet 01_main; Manufacturer P/N: C2012X7S1A226M125; Tolerance: ±20%; Voltage: 10V; Package: 0805
C10 C12 C13 C15-C19 C21 C24 C26 C27 C60 = CAP: as C34 on sheet 01_main; Manufacturer P/N: GCM155R71H104KE02; Tolerance: ±10%; Voltage: 50V; Footprint: *; Package: 0402
C20 = CAP: as C39 on sheet 03_cellular; Manufacturer P/N: GRM155R71H103KA88; Tolerance: ±10%; Voltage: 50V; Package: 0402
C22 = CAP: as C28 on sheet 01_main; Manufacturer P/N: C1608X7R1A225M080; Tolerance: ±20%; Voltage: 10V; Footprint: *; Package: 0603
C41 C47 C56 C58 = CAP 0402: Ceramic Capacitor 10nF ±10% 25V X7R 0402; Manufacturer: Murata; Tr: -55:125; Voltage: 25V; Manufacturer P/N: GRM155R71E103KA01D; Package: 0402; Tolerance: ±10%
C42 C50 C51 C61 = CAP 0402: Ceramic Capacitor 1nF ±5% 50V NP0 0402; Manufacturer: Murata; Tr: -55:125; Voltage: 50V; Manufacturer P/N: GRM1555C1H102JA01D; Package: 0402; Tolerance: ±5%
C44 C46 C55 C59 = CAP 0402: Ceramic Capacitor 100nF ±10% 16V X7R 0402; Manufacturer: Murata; Tr: -55:125; Voltage: 16V; Manufacturer P/N: GRM155R71C104KA88J; Package: 0402; Tolerance: ±10%
C62 C63 = CAP 0402: Ceramic Capacitor 6pF ±0.25pF 50V NP0 RF 0402; Manufacturer: Murata; Tr: -55:125; Voltage: 50V; Manufacturer P/N: GJM1555C1H6R0CB01D; Package: 0402; Tolerance: ±0.25pF
D4 = LED0603Y: LED, SMT 0603, Color Amber, 10mA, 2.05V; Manufacturer: Panasonic; Manufacturer P/N: LNJ412K84RA; Package: 0603 Polarized
D5 = LED0603GR: LED, SMT 0603, Color Green, 10mA, 2.05V; Manufacturer: Panasonic; Manufacturer P/N: LNJ326W83RA; Package: 0603 Polarized
L1-L3 = IND 0402: Ferrite Bead 600-Ohm @ 100MHz 900mA 0402; Manufacturer: Murata; Tolerance: ±25%; Tr: -55:125; Manufacturer P/N: BLM15PX601SN1D; Package: 0402
L6 = INDUCTOR: 4.7uH Inductor 750mA 260mOhm 0805; Manufacturer: Samsung; Manufacturer P/N: CIG21L4R7MNE
R10 R11 = RES: as R7 on sheet 01_main; Tolerance: ±1%; Manufacturer P/N: ERJ-2RKF2400X; Alternatives: *; Footprint: *; Package: 0402
R12-R15 R17 R42 R53-R55 = RES: as R18 on sheet 01_main; Tolerance: ±1%; Manufacturer P/N: ERJ-2RKF4701X; Alternatives: *; Footprint: *; Package: 0402
R31 R33-R35 R40 R41 R45-R52 = RES: Thick Film Resistor 20 ±1% 0.1W 75V 0402; Manufacturer: Panasonic; Tcr: ±100; Tr: -55:155; Voltage: 75; Power: 0.1; Tolerance: ±1%; Manufacturer P/N: ERJ-2RKF20R0X; Alternatives: *; Footprint: *; Package: 0402
R32 R44 = RES 0402: as R2 on sheet 01_main; Package: 0402; Tolerance: ±1%
R43 = RES: Thick Film Resistor 2.49k ±1% 0.1W 75V 0402; Manufacturer: Panasonic; Tcr: ±100; Tr: -55:155; Voltage: 75; Power: 0.1; Tolerance: ±1%; Manufacturer P/N: ERJ-2RKF2491X; Alternatives: *; Footprint: *; Package: 0402
R56 = RES: Thick Film Resistor 1.5k ±1% 0.1W 75V 0402; Manufacturer: Panasonic; Tcr: ±100; Tr: -55:155; Voltage: 75; Power: 0.1; Tolerance: ±1%; Manufacturer P/N: ERJ-2RKF1501X; Alternatives: *; Footprint: *; Package: 0402
T1 = S558-5999-M8-F: Gigabit LAN transformer; Manufacturer: Bel Fuse; Manufacturer P/N: S558-5999-M8-F
U6 U9 = ICMEF112P900MFR_5: Ultra-low Capacitance TVS Diodes; Manufacturer: Alpha & Omega; Manufacturer P/N: AOZ8804
U10 = SLG59M1440V: Ultra-small 1.5A High-Side Load Switch; Manufacturer: Silego; Manufacturer P/N: SLG59M1440V
U11 = CON_40P_6.5mm: Gigabit Ethernet Transceiver; Manufacturer: Realtek; Manufacturer P/N: RTL8211E-VB-CG
Y1 = XRCGB25M000F3N00R0: CRYSTAL, 25.000MHz, 30ppm, 6pF; Manufacturer: Murata; Manufacturer P/N: XRCGB25M000F3N00R0; C: 6pF

## Sheet 05_power.SchDoc
size D; CompanyName: Signal Laboratories, Inc.; Address1: 3479 Edison Way; Address2: Menlo Park CA 94025; Address3: +1 (877) 778-8435; Address4: siglabs.com; Revision: 1; SheetNumber: 1; SheetTotal: 1
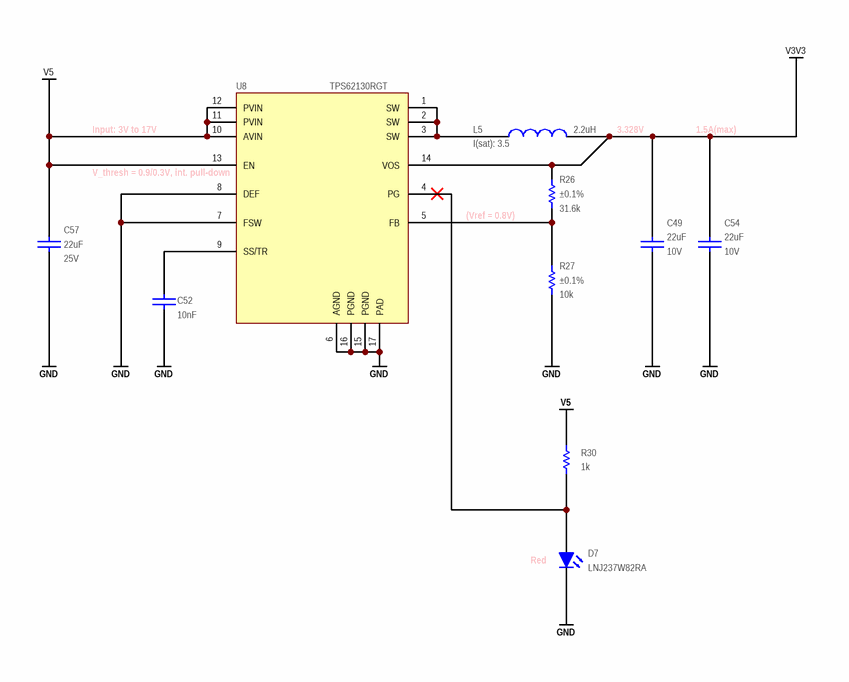
[diagram p16: 05_power.SchDoc]

### Parts
C49  value 22uF  Voltage: 10V  [CAPC200X125X145L45N]  (hidden comment: C2012X7S1A226M125)
C52  value 10nF  [CAPC100X50X55L25N]  (hidden comment: GRM155R71H103KA88)
C54  value 22uF  Voltage: 10V  [CAPC200X125X145L45N]  (hidden comment: C2012X7S1A226M125)
C57  value 22uF  Voltage: 25V  [CAPC320X250X270L50N]  (hidden comment: GRM32ER71E226KE15)
D7  LNJ237W82RA  [0603_LED]
L5  value 2.2uH  I(sat): 3.5  [XFL4020]  (hidden comment: XFL4020-222ME)
R26  value 31.6k  Tolerance: ±0.1%  [RESC2012X70N]  (hidden comment: ERA-6AEB3162V)
R27  value 10k  Tolerance: ±0.1%  [RESC2012X70N]  (hidden comment: ERA-6AEB103V)
R30  value 1k  [RESC1005X40N]  (hidden comment: ERJ-2RKF1001X)
U8  TPS62130RGT  [S-PQFP-8N]

### Nets
GND: C49.1 C52.2 C54.1 C57.1 D7.2(K) R27.1 U8.6(AGND) U8.7(FSW) U8.8(DEF) U8.15(PGND) U8.16(PGND) U8.17(PAD)
V3V3: C49.2 C54.2 L5.2 R26.2 U8.14(VOS)
V5: C57.2 R30.2 U8.10(AVIN) U8.11(PVIN) U8.12(PVIN) U8.13(EN)
NetC52_1: C52.1 U8.9(SS/TR)
NetD7_1: D7.1(A) R30.1 U8.4(PG)
NetL5_1: L5.1 U8.1(SW) U8.2(SW) U8.3(SW)
NetR26_1: R26.1 R27.2 U8.5(FB)

### Notes on the sheet
- Input: 3V to 17V
- 3.328V
- 1.5A(max)
- (near U8) V_thresh = 0.9/0.3V, int. pull-down
- (near R26) (Vref = 0.8V)
- (near D7) Red
- Title
- Engineer
- Revision
- Drawn By
- Sheet
- of
- Checked By
- Date

### Library data of the parts
C49 C54 = CAP: as C33 on sheet 01_main; Manufacturer P/N: C2012X7S1A226M125; Tolerance: ±20%; Package: 0805
C52 = CAP: as C39 on sheet 03_cellular; Manufacturer P/N: GRM155R71H103KA88; Tolerance: ±10%; Voltage: 50V; Package: 0402
C57 = CAP: Ceramic Capacitor 22uF ±10% 25V X7R 1210; Manufacturer: Murata; Tr: -55:125; Manufacturer P/N: GRM32ER71E226KE15; Tolerance: ±10%; Package: 1210
D7 = LED0603RD: as D1 on sheet 01_main; Manufacturer P/N: LNJ237W82RA; Package: 0603 Polarized
L5 = COIL: Wirewound Inductor 2.2uH +/-20% 3.5A SMD; Manufacturer: Coilcraft; Manufacturer P/N: XFL4020-222ME
R26 = RES: Thin Film Resistor 31.6k ±0.1% 0.125W 100V 0805; Manufacturer: Panasonic; Tcr: ±25; Tr: -55:155; Voltage: 100; Power: 0.125; Manufacturer P/N: ERA-6AEB3162V; Package: 0805
R27 = RES: Thin Film Resistor 10k ±0.1% 0.125W 100V 0805; Manufacturer: Panasonic; Tcr: ±25; Tr: -55:155; Voltage: 100; Power: 0.125; Manufacturer P/N: ERA-6AEB103V; Package: 0805
R30 = RES: Thick Film Resistor 1k ±1% 0.1W 0402; Manufacturer: Panasonic; Tcr: ±100; Tr: -55:155; Voltage: 50; Power: 0.1; Manufacturer P/N: ERJ-2RKF1001X; Tolerance: ±1%; Alternatives: *; Footprint: *; Package: 0402
U8 = TPS62130RGT: 3-17V 3A Step-Down Converter VQFN; Manufacturer: Texas Instruments; Manufacturer P/N: TPS62130RGT